# Altium project LPCB235__RLOOP__FCU.PrjPCB (part 3 of 7)

## Sheet LPCB235 - RM48 - ANALOG.SchDoc
size A3; Address1: Unit 4; DocumentNumber: 25; Revision: 2; SheetNumber: 25; SheetTotal: 37; Lockie__PCB_SUB_ASSEMBLY: Analog; Lockie__PCB_ASSEMBLY: FCU PCB; Lockie__LDL: LPCB235; Lockie__PCB_DESCRIPTION: Flight Control Unit
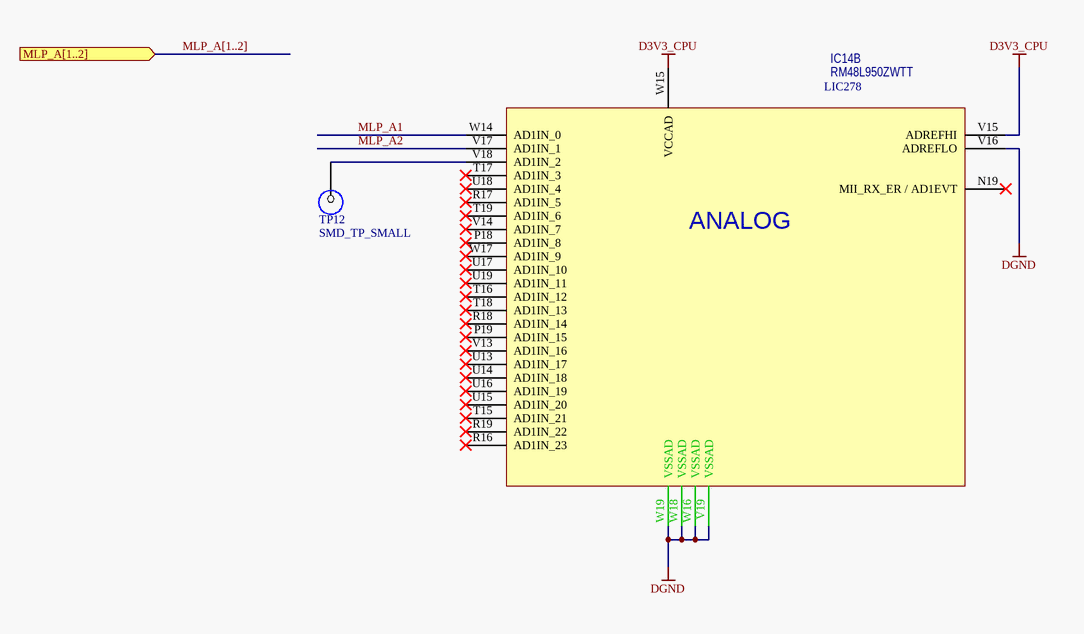
[diagram p5: LPCB235 - RM48 - ANALOG.SchDoc]

### Parts
IC14  RM48L950ZWTT  LDL_NUMBER: LIC278  [LFP054__ZWT (S-PBGA-N337)]  (part B of 10)
TP12  SMD_TP_SMALL  [SMD-TP-SMALL]  (no BOM)

### Ports
MLP_A[1..2] (in)

### Nets
D3V3_CPU: IC14.V15(ADREFHI) IC14.W15(VCCAD)
DGND: IC14.V16(ADREFLO) IC14.V19(VSSAD) IC14.W16(VSSAD) IC14.W18(VSSAD) IC14.W19(VSSAD)
MLP_A1: IC14.W14(AD1IN_0)
MLP_A2: IC14.V17(AD1IN_1)
NetIC14_N19: IC14.N19(MII_RX_ER_/_AD1EVT)
NetIC14_V18: IC14.V18(AD1IN_2) TP12.1

Not connected (* = marked no-connect by the designer): IC14 P18(AD1IN_8)* P19(AD1IN_15)* R16(AD1IN_23)* R17(AD1IN_5)* R18(AD1IN_14)* R19(AD1IN_22)* T15(AD1IN_21)* T16(AD1IN_12)* T17(AD1IN_3)* T18(AD1IN_13)* T19(AD1IN_6)* U13(AD1IN_17)* U14(AD1IN_18)* U15(AD1IN_20)* U16(AD1IN_19)* U17(AD1IN_10)* U18(AD1IN_4)* U19(AD1IN_11)* V13(AD1IN_16)* V14(AD1IN_7)* W17(AD1IN_9)*

### Buses and harness runs
bus MLP_A[1..2] = port MLP_A[1..2]

### Notes on the sheet
- PCB COMPONENT DESCRIPTION
- LDL NUMBER
- Assembly Details
- Size
- Drawing File Name
- Revision
- http://rloop.org
- Scale
- A3
- Sheet Details
- N.T.S
- Sheet:
- Of:
- (in symbol RM48L950ZWTT, part B) ANALOG

### Library data of the parts
IC14 = RM48L950ZWTT: IC, CPU, RM48 Safety CPU, SMD NFBGA337 [LIC278]; FMEDA__FUNCTION_IN_SYSTEM: SAFETY CPU 1; FMEDA__OPERATING__TEMP_MIN: -20; FMEDA__OPERATING__TEMP_TYP: 27; FMEDA__OPERATING__TEMP_MAX: 50; FMEDA__CHANNEL: COM
TP12 = SMD_TP_SMALL: SMD Test Point; FMEDA__CHANNEL: COM; FMEDA__OPERATING__CURRENT_MAX: 0; FMEDA__OPERATING__TEMP_MAX: 50; FMEDA__OPERATING__TEMP_MIN: -20; FMEDA__OPERATING__TEMP_TYP: 27; FMEDA__OPERATING__VOLTAGE_MAX: 16; FMEDA__OPERATING__VOLTAGE_TYP: 12; FMEDA__OPERATING__CURRENT_MIN: 0; FMEDA__OPERATING__CURRENT_TYP: 0; FMEDA__OPERATING__VOLTAGE_MIN: 0

## Sheet LPCB235 - RM48 - EMIF.SchDoc
size A3; Address1: Unit 4; DocumentNumber: 26; Revision: 2; SheetNumber: 26; SheetTotal: 37; Lockie__PCB_SUB_ASSEMBLY: EMIF; Lockie__PCB_ASSEMBLY: FCU PCB; Lockie__LDL: LPCB235; Lockie__PCB_DESCRIPTION: Flight Control Unit
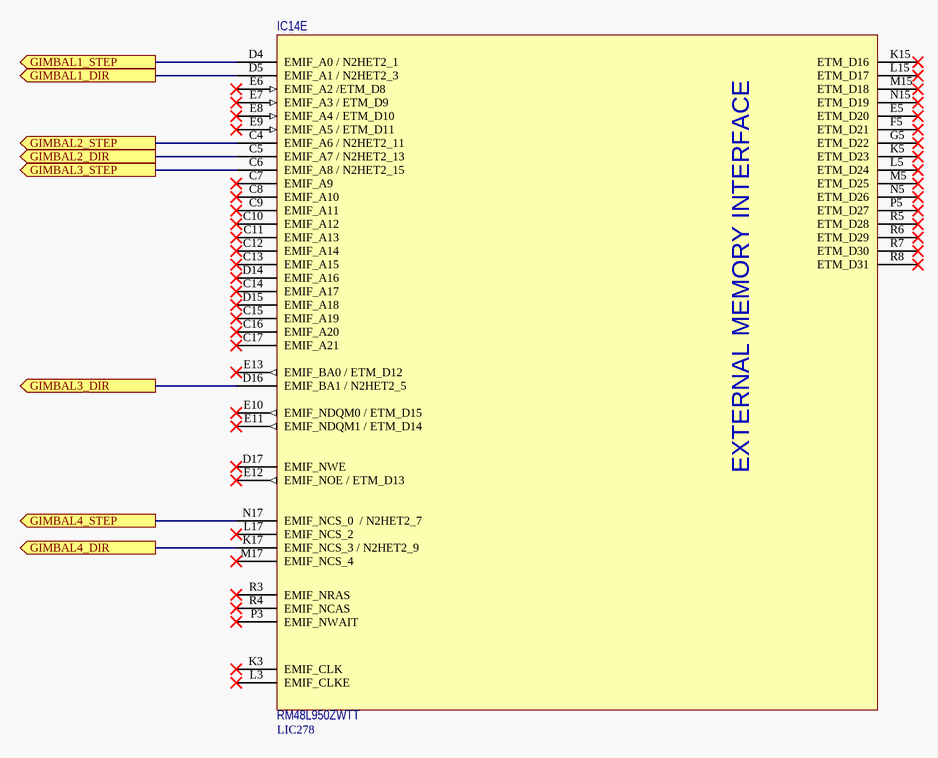
[diagram p6: LPCB235 - RM48 - EMIF.SchDoc]

### Parts
IC14  RM48L950ZWTT  LDL_NUMBER: LIC278  [LFP054__ZWT (S-PBGA-N337)]  (part E of 10)

### Ports
GIMBAL1_DIR (out), GIMBAL1_STEP (out), GIMBAL2_DIR (out), GIMBAL2_STEP (out), GIMBAL3_DIR (out), GIMBAL3_STEP (out), GIMBAL4_DIR (out), GIMBAL4_STEP (out)

### Nets
NetIC14_C4: IC14.C4(EMIF_A6_/_N2HET2_11) ; port GIMBAL2_STEP
NetIC14_C5: IC14.C5(EMIF_A7_/_N2HET2_13) ; port GIMBAL2_DIR
NetIC14_C6: IC14.C6(EMIF_A8_/_N2HET2_15) ; port GIMBAL3_STEP
NetIC14_D4: IC14.D4(EMIF_A0_/_N2HET2_1) ; port GIMBAL1_STEP
NetIC14_D5: IC14.D5(EMIF_A1_/_N2HET2_3) ; port GIMBAL1_DIR
NetIC14_D16: IC14.D16(EMIF_BA1_/_N2HET2_5) ; port GIMBAL3_DIR
NetIC14_K17: IC14.K17(EMIF_NCS_3_/_N2HET2_9) ; port GIMBAL4_DIR
NetIC14_N17: IC14.N17(EMIF_NCS_0__/_N2HET2_7) ; port GIMBAL4_STEP

Not connected (* = marked no-connect by the designer): IC14 C7(EMIF_A9)* C8(EMIF_A10)* C9(EMIF_A11)* C10(EMIF_A12)* C11(EMIF_A13)* C12(EMIF_A14)* C13(EMIF_A15)* C14(EMIF_A17)* C15(EMIF_A19)* C16(EMIF_A20)* C17(EMIF_A21)* D14(EMIF_A16)* D15(EMIF_A18)* D17(EMIF_NWE)* E5(ETM_D20)* E6(EMIF_A2_/ETM_D8)* E7(EMIF_A3_/_ETM_D9)* E8(EMIF_A4_/_ETM_D10)* E9(EMIF_A5_/_ETM_D11)* E10(EMIF_NDQM0_/_ETM_D15)* E11(EMIF_NDQM1_/_ETM_D14)* E12(EMIF_NOE_/_ETM_D13)* E13(EMIF_BA0_/_ETM_D12)* F5(ETM_D21)* G5(ETM_D22)* K3(EMIF_CLK)* K5(ETM_D23)* K15(ETM_D16)* L3(EMIF_CLKE)* L5(ETM_D24)* L15(ETM_D17)* L17(EMIF_NCS_2)* M5(ETM_D25)* M15(ETM_D18)* M17(EMIF_NCS_4)* N5(ETM_D26)* N15(ETM_D19)* P3(EMIF_NWAIT)* P5(ETM_D27)* R3(EMIF_NRAS)* R4(EMIF_NCAS)* R5(ETM_D28)* R6(ETM_D29)* R7(ETM_D30)* R8(ETM_D31)*

### Notes on the sheet
- PCB COMPONENT DESCRIPTION
- LDL NUMBER
- Assembly Details
- Size
- Drawing File Name
- Revision
- http://rloop.org
- Scale
- A3
- Sheet Details
- N.T.S
- Sheet:
- Of:
- (in symbol RM48L950ZWTT, part E) EXTERNAL MEMORY INTERFACE

### Library data of the parts
IC14 = RM48L950ZWTT: as IC14 on sheet LPCB235 - RM48 - ANALOG

## Sheet LPCB235 - RM48 - MAIN.SchDoc
size A3; Address1: Unit 4; DocumentNumber: 28; Revision: 2; SheetNumber: 28; SheetTotal: 37; Lockie__PCB_SUB_ASSEMBLY: Main; Lockie__PCB_ASSEMBLY: FCU PCB; Lockie__LDL: LPCB235; Lockie__PCB_DESCRIPTION: Flight Control Unit
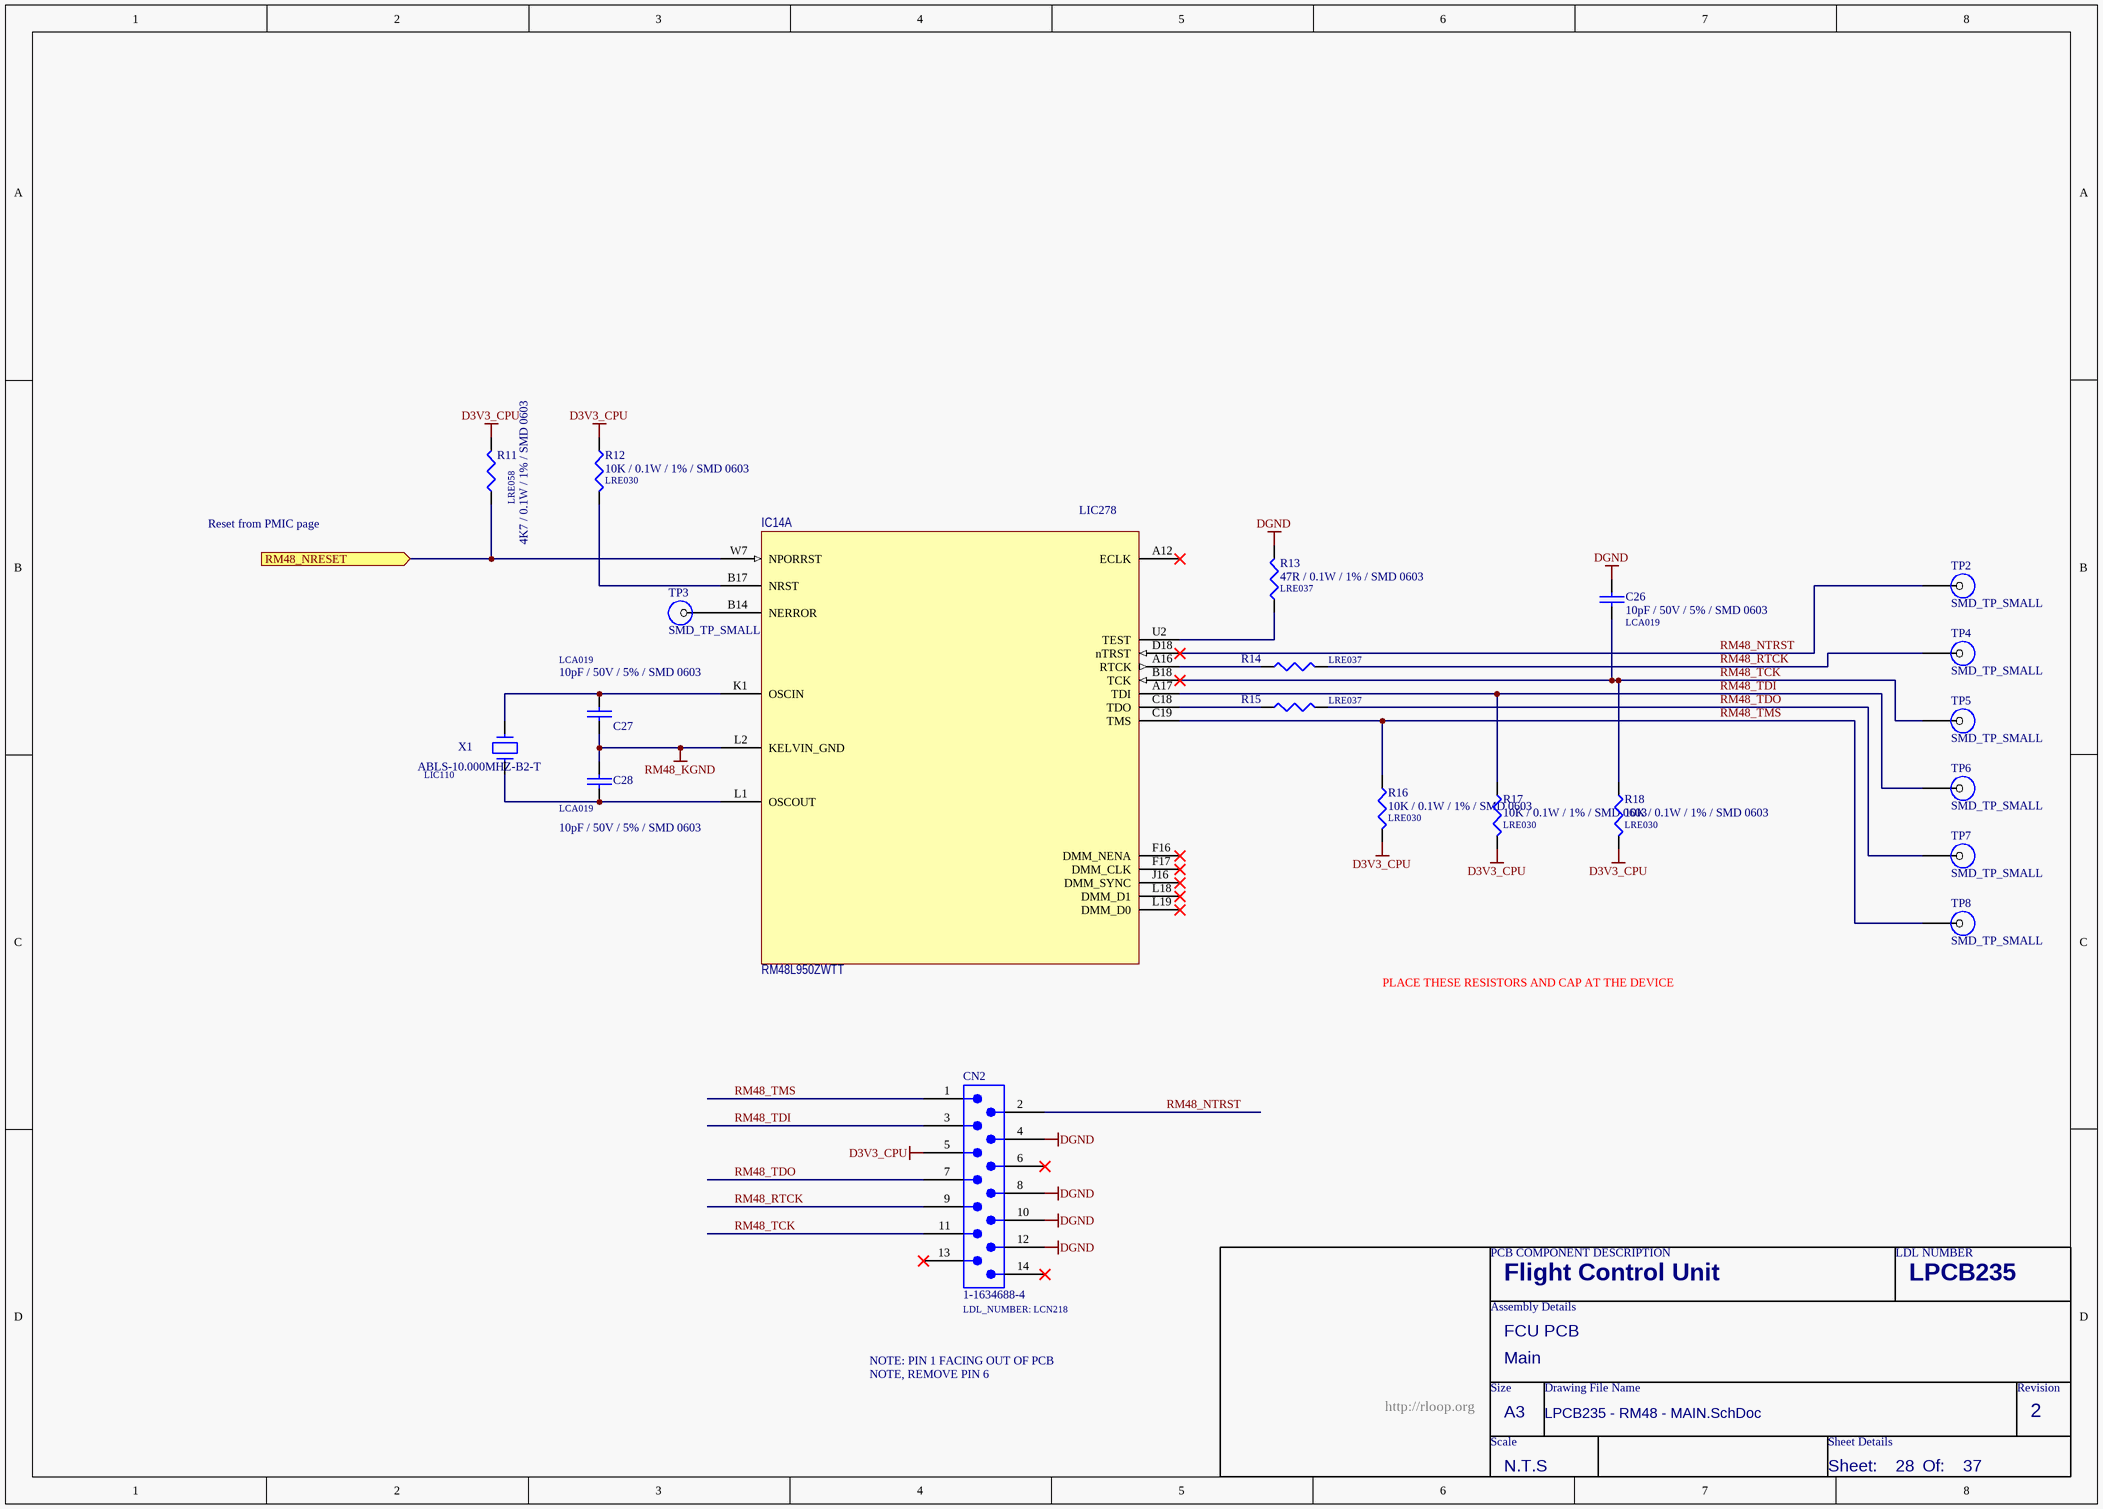
[diagram p7: LPCB235 - RM48 - MAIN.SchDoc]

### Parts
C26  10pF / 50V / 5% / SMD 0603  LDL_NUMBER: LCA019  [LFP011__CC1608-0603-IPC7351_B]
C27  10pF / 50V / 5% / SMD 0603  LDL_NUMBER: LCA019  [LFP011__CC1608-0603-IPC7351_B]
C28  10pF / 50V / 5% / SMD 0603  LDL_NUMBER: LCA019  [LFP011__CC1608-0603-IPC7351_B]
CN2  1-1634688-4  LDL_NUMBER: LCN218  [1-1634688-4]
IC14  RM48L950ZWTT  LDL_NUMBER: LIC278  [LFP054__ZWT (S-PBGA-N337)]  (part A of 10)
R11  4K7 / 0.1W / 1% / SMD 0603  LDL_NUMBER: LRE058  [LFP020__CR1608-0603-IPC7351_B]
R12  10K / 0.1W / 1% / SMD 0603  LDL_NUMBER: LRE030  [LFP020__CR1608-0603-IPC7351_B]
R13  47R / 0.1W / 1% / SMD 0603  LDL_NUMBER: LRE037  [LFP020__CR1608-0603-IPC7351_B]
R14  LDL_NUMBER: LRE037  [LFP020__CR1608-0603-IPC7351_B]  (hidden comment: 47R / 0.1W / 1% / SMD 0603)
R15  LDL_NUMBER: LRE037  [LFP020__CR1608-0603-IPC7351_B]  (hidden comment: 47R / 0.1W / 1% / SMD 0603)
R16  10K / 0.1W / 1% / SMD 0603  LDL_NUMBER: LRE030  [LFP020__CR1608-0603-IPC7351_B]
R17  10K / 0.1W / 1% / SMD 0603  LDL_NUMBER: LRE030  [LFP020__CR1608-0603-IPC7351_B]
R18  10K / 0.1W / 1% / SMD 0603  LDL_NUMBER: LRE030  [LFP020__CR1608-0603-IPC7351_B]
TP2  SMD_TP_SMALL  [SMD-TP-SMALL]  (no BOM)
TP3  SMD_TP_SMALL  [SMD-TP-SMALL]  (no BOM)
TP4  SMD_TP_SMALL  [SMD-TP-SMALL]  (no BOM)
TP5  SMD_TP_SMALL  [SMD-TP-SMALL]  (no BOM)
TP6  SMD_TP_SMALL  [SMD-TP-SMALL]  (no BOM)
TP7  SMD_TP_SMALL  [SMD-TP-SMALL]  (no BOM)
TP8  SMD_TP_SMALL  [SMD-TP-SMALL]  (no BOM)
X1  ABLS-10.000MHZ-B2-T  LDL_NUMBER: LIC110  [LFP022__XT49M]

### Ports
RM48_NRESET (in)

### Nets
D3V3_CPU: CN2.5 R11.2 R12.1 R16.2 R17.2 R18.2
DGND: C26.2 CN2.4 CN2.8 CN2.10 CN2.12 R13.2
RM48_KGND: C27.2 C28.1 IC14.L2(KELVIN_GND)
RM48_NRESET: IC14.W7(NPORRST) R11.1 ; port RM48_NRESET
RM48_NTRST: CN2.2 IC14.D18(nTRST) TP2.1
RM48_RTCK: CN2.9 R14.2 TP4.1
RM48_TCK: C26.1 CN2.11 IC14.B18(TCK) R18.1 TP5.1
RM48_TDI: CN2.3 IC14.A17(TDI) R17.1 TP6.1
RM48_TDO: CN2.7 R15.2 TP7.1
RM48_TMS: CN2.1 IC14.C19(TMS) R16.1 TP8.1
NetC27_1: C27.1 IC14.K1(OSCIN) X1.2
NetC28_2: C28.2 IC14.L1(OSCOUT) X1.1
NetIC14_A16: IC14.A16(RTCK) R14.1
NetIC14_B14: IC14.B14(NERROR) TP3.1
NetIC14_B17: IC14.B17(NRST) R12.2
NetIC14_C18: IC14.C18(TDO) R15.1
NetIC14_U2: IC14.U2(TEST) R13.1

Not connected (* = marked no-connect by the designer): CN2 6* 13* 14*; IC14 A12(ECLK)* F16(DMM_NENA)* F17(DMM_CLK)* J16(DMM_SYNC)* L18(DMM_D1)* L19(DMM_D0)*

### Notes on the sheet
- Reset from PMIC page
- PLACE THESE RESISTORS AND CAP AT THE DEVICE
- NOTE: PIN 1 FACING OUT OF PCB
- NOTE, REMOVE PIN 6
- PCB COMPONENT DESCRIPTION
- LDL NUMBER
- Assembly Details
- Size
- Drawing File Name
- Revision
- http://rloop.org
- Scale
- A3
- Sheet Details
- N.T.S
- Sheet:
- Of:

### Library data of the parts
C26-C28 = 10pF / 50V / 5% / SMD 0603: Capacitor, Ceramic Chip, 10pF, 50V, 5%, SMD 0603 [LCA019]; Value: 10p; FMEDA__OPERATING__VOLTAGE_MAX: 3.3; FMEDA__OPERATING__VOLTAGE_MIN: 0; FMEDA__OPERATING__TEMP_MAX: 50; FMEDA__OPERATING__TEMP_MIN: -20; FMEDA__OPERATING__TEMP_TYP: 27; FMEDA__CHANNEL: COM; FMEDA__FUNCTION_IN_SYSTEM: *; FMEDA__OPERATING__VOLTAGE_TYP: 3.3
CN2 = 1-1634688-4: Connector, Box Header, 14 Way, 2.54mm Straight, PTH; FMEDA__CHANNEL: COM; FMEDA__OPERATING__CURRENT_MAX: 0; FMEDA__OPERATING__TEMP_MAX: 50; FMEDA__OPERATING__TEMP_MIN: -20; FMEDA__OPERATING__TEMP_TYP: 27; FMEDA__OPERATING__VOLTAGE_MAX: 16; FMEDA__OPERATING__VOLTAGE_TYP: 12; FMEDA__OPERATING__CURRENT_MIN: 0; FMEDA__OPERATING__CURRENT_TYP: 0; FMEDA__OPERATING__VOLTAGE_MIN: 0
IC14 = RM48L950ZWTT: as IC14 on sheet LPCB235 - RM48 - ANALOG
R11 = 4K7 / 0.1W / 1% / SMD 0603: Resistor, Ceramic Chip, 4K7, 0.1W, 1%, SMD 0603 [LRE058]; VALUE: 4.7K; FMEDA__OPERATING__POWER_MAX: 0; FMEDA__OPERATING__TEMP_MAX: 50; FMEDA__OPERATING__TEMP_MIN: -20; FMEDA__OPERATING__TEMP_TYP: 27; FMEDA__CHANNEL: COM; FMEDA__OPERATING__POWER_MIN: 0; FMEDA__OPERATING__VOLTAGE_MAX: 0; FMEDA__OPERATING__VOLTAGE_MIN: 0; FMEDA__OPERATING__VOLTAGE_TYP: 0; FMEDA__FUNCTION_IN_SYSTEM: *
R12 R16-R18 = 10K / 0.1W / 1% / SMD 0603: Resistor, Ceramic Chip, 10K, 0.1W, 1%, SMD 0603 [LRE030]; FMEDA__OPERATING__POWER_MAX: 0; FMEDA__OPERATING__TEMP_MAX: 50; FMEDA__OPERATING__TEMP_MIN: -20; FMEDA__OPERATING__TEMP_TYP: 27; FMEDA__CHANNEL: COM; Value: 10K; FMEDA__OPERATING__POWER_MIN: 0; FMEDA__OPERATING__VOLTAGE_MAX: 0; FMEDA__OPERATING__VOLTAGE_MIN: 0; FMEDA__OPERATING__VOLTAGE_TYP: 0; FMEDA__FUNCTION_IN_SYSTEM: *
R13-R15 = 47R / 0.1W / 1% / SMD 0603: Resistor, Ceramic Chip, 47R, 0.1W, 1%, SMD 0603 [LRE037]; VALUE: 47; FMEDA__OPERATING__POWER_MAX: 0; FMEDA__OPERATING__TEMP_MAX: 50; FMEDA__OPERATING__TEMP_MIN: -20; FMEDA__OPERATING__TEMP_TYP: 27; FMEDA__CHANNEL: COM; FMEDA__OPERATING__POWER_MIN: 0; FMEDA__OPERATING__VOLTAGE_MAX: 0; FMEDA__OPERATING__VOLTAGE_MIN: 0; FMEDA__OPERATING__VOLTAGE_TYP: 0; FMEDA__FUNCTION_IN_SYSTEM: *
TP2-TP8 = SMD_TP_SMALL: as TP12 on sheet LPCB235 - RM48 - ANALOG; FMEDA__OPERATING__CURRENT_MIN: 0; FMEDA__OPERATING__CURRENT_TYP: 0; FMEDA__OPERATING__VOLTAGE_MIN: 0
X1 = ABLS-10.000MHZ-B2-T: Crystal, 10MHz, 18pF, SMD [LIC110]; FMEDA__OPERATING__TEMP_MAX: 50; FMEDA__OPERATING__TEMP_TYP: 27; FMEDA__OPERATING__TEMP_MIN: -20; FMEDA__CHANNEL: COM; FMEDA__FUNCTION_IN_SYSTEM: *

## Sheet LPCB235 - CAN Interface.SchDoc
size A3; Address1: Unit 4; DocumentNumber: 22; Revision: 2; SheetNumber: 22; SheetTotal: 37; Lockie__PCB_SUB_ASSEMBLY: CAN Interface; Lockie__PCB_ASSEMBLY: FCU PCB; Lockie__LDL: LPCB235; Lockie__PCB_DESCRIPTION: Flight Control Unit
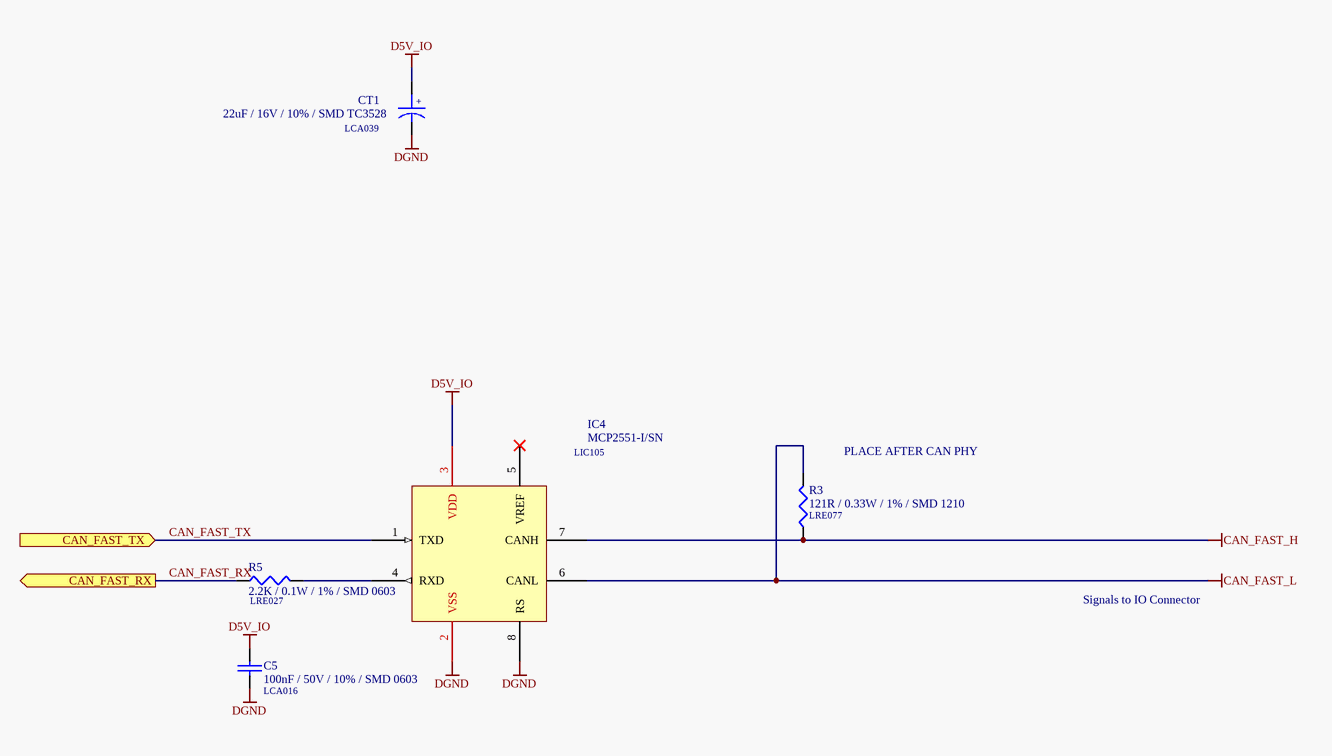
[diagram p8: LPCB235 - CAN Interface.SchDoc]

### Parts
C5  100nF / 50V / 10% / SMD 0603  LDL_NUMBER: LCA016  [LFP011__CC1608-0603-IPC7351_B]
CT1  22uF / 16V / 10% / SMD TC3528  LDL_NUMBER: LCA039  [LFP018__TC3528]
IC4  MCP2551-I/SN  LDL_NUMBER: LIC105  [LFP017__SO-G8/Y1.9]
R3  121R / 0.33W / 1% / SMD 1210  LDL_NUMBER: LRE077  [LFP028__CR3225-1210]
R5  2.2K / 0.1W / 1% / SMD 0603  LDL_NUMBER: LRE027  [LFP020__CR1608-0603-IPC7351_B]

### Ports
CAN_FAST_RX (out), CAN_FAST_TX (in)

### Nets
CAN_FAST_H: IC4.7(CANH) R3.1
CAN_FAST_L: IC4.6(CANL) R3.2
D5V_IO: C5.1 CT1.1 IC4.3(VDD)
DGND: C5.2 CT1.2 IC4.2(VSS) IC4.8(RS)
CAN_FAST_RX: R5.1 ; port CAN_FAST_RX
CAN_FAST_TX: IC4.1(TXD) ; port CAN_FAST_TX
NetIC4_4: IC4.4(RXD) R5.2

Not connected (* = marked no-connect by the designer): IC4 5(VREF)*

### Notes on the sheet
- (near R3) PLACE AFTER CAN PHY
- Signals to IO Connector
- PCB COMPONENT DESCRIPTION
- LDL NUMBER
- Assembly Details
- Size
- Drawing File Name
- Revision
- http://rloop.org
- Scale
- A3
- Sheet Details
- N.T.S
- Sheet:
- Of:
- (in symbol 22uF / 16V / 10% / SMD TC3528) +

### Library data of the parts
C5 = 100nF / 50V / 10% / SMD 0603: Capacitor, Ceramic Chip, 100nF (0.1uF), 50V, 5%, SMD 0603 [LCA016]; Value: 100n; FMEDA__OPERATING__VOLTAGE_MIN: 0; FMEDA__OPERATING__VOLTAGE_MAX: 3.3; FMEDA__OPERATING__TEMP_MIN: -20; FMEDA__OPERATING__TEMP_TYP: 27; FMEDA__OPERATING__TEMP_MAX: 50; FMEDA__CHANNEL: COM; FMEDA__FUNCTION_IN_SYSTEM: *; FMEDA__OPERATING__VOLTAGE_TYP: 3.3
CT1 = 22uF / 16V / 10% / SMD TC3528: Capacitor, Tantalum, 22uF, 16V, 10%, SMD TC3528 (BCASE) [LCA039]; Value: 22u; FMEDA__OPERATING__VOLTAGE_MAX: 3.3; FMEDA__OPERATING__VOLTAGE_MIN: 0; FMEDA__OPERATING__TEMP_MAX: 50; FMEDA__OPERATING__TEMP_MIN: -20; FMEDA__OPERATING__TEMP_TYP: 27; FMEDA__FUNCTION_IN_SYSTEM: CAN PHY BYPASS CAP; FMEDA__CHANNEL: COM; FMEDA__OPERATING__VOLTAGE_TYP: 3.3
IC4 = MCP2551-I/SN: IC, High Speed CAN Transceiver, SMD SOIC8 [LIC105]; FMEDA__OPERATING__TEMP_MAX: 50; FMEDA__OPERATING__TEMP_MIN: -20; FMEDA__OPERATING__TEMP_TYP: 27; FMEDA__OPERATING__VOLTAGE_MAX: 0; FMEDA__FUNCTION_IN_SYSTEM: CAN PHY 1; FMEDA__CHANNEL: COM; FMEDA__OPERATING__VOLTAGE_MIN: 0; FMEDA__OPERATING__VOLTAGE_TYP: 0
R3 = 121R / 0.33W / 1% / SMD 1210: Resistor, Ceramic Chip, 121R, 0.33W, 1%, SMD 1210 [LRE077]; VALUE: 121; FMEDA__OPERATING__POWER_MAX: 0; FMEDA__OPERATING__TEMP_MAX: 50; FMEDA__OPERATING__TEMP_MIN: -20; FMEDA__OPERATING__TEMP_TYP: 27; FMEDA__CHANNEL: COM; FMEDA__OPERATING__POWER_MIN: 0; FMEDA__OPERATING__VOLTAGE_MAX: 0; FMEDA__OPERATING__VOLTAGE_MIN: 0; FMEDA__OPERATING__VOLTAGE_TYP: 0; FMEDA__FUNCTION_IN_SYSTEM: *
R5 = 2.2K / 0.1W / 1% / SMD 0603: Resistor, Ceramic Chip, 2.2K, 0.1W, 1%, SMD 0603 [LRE027]; FMEDA__OPERATING__VOLTAGE_MIN: 0; FMEDA__FUNCTION_IN_SYSTEM: CAN PHY 1 ILIM; FMEDA__OPERATING__TEMP_MIN: -20; FMEDA__OPERATING__TEMP_TYP: 27; FMEDA__OPERATING__TEMP_MAX: 50; FMEDA__CHANNEL: COM; VALUE: 2.2K; FMEDA__OPERATING__VOLTAGE_MAX: 0; FMEDA__OPERATING__POWER_MIN: 0; FMEDA__OPERATING__POWER_MAX: 0; FMEDA__OPERATING__VOLTAGE_TYP: 0

## Sheet LPCB235 - RM48 - SERIAL.SchDoc
size A3; Address1: Unit 4; DocumentNumber: 31; Revision: 2; SheetNumber: 31; SheetTotal: 37; Lockie__PCB_SUB_ASSEMBLY: Serial IO; Lockie__PCB_ASSEMBLY: FCU PCB; Lockie__LDL: LPCB235; Lockie__PCB_DESCRIPTION: Flight Control Unit
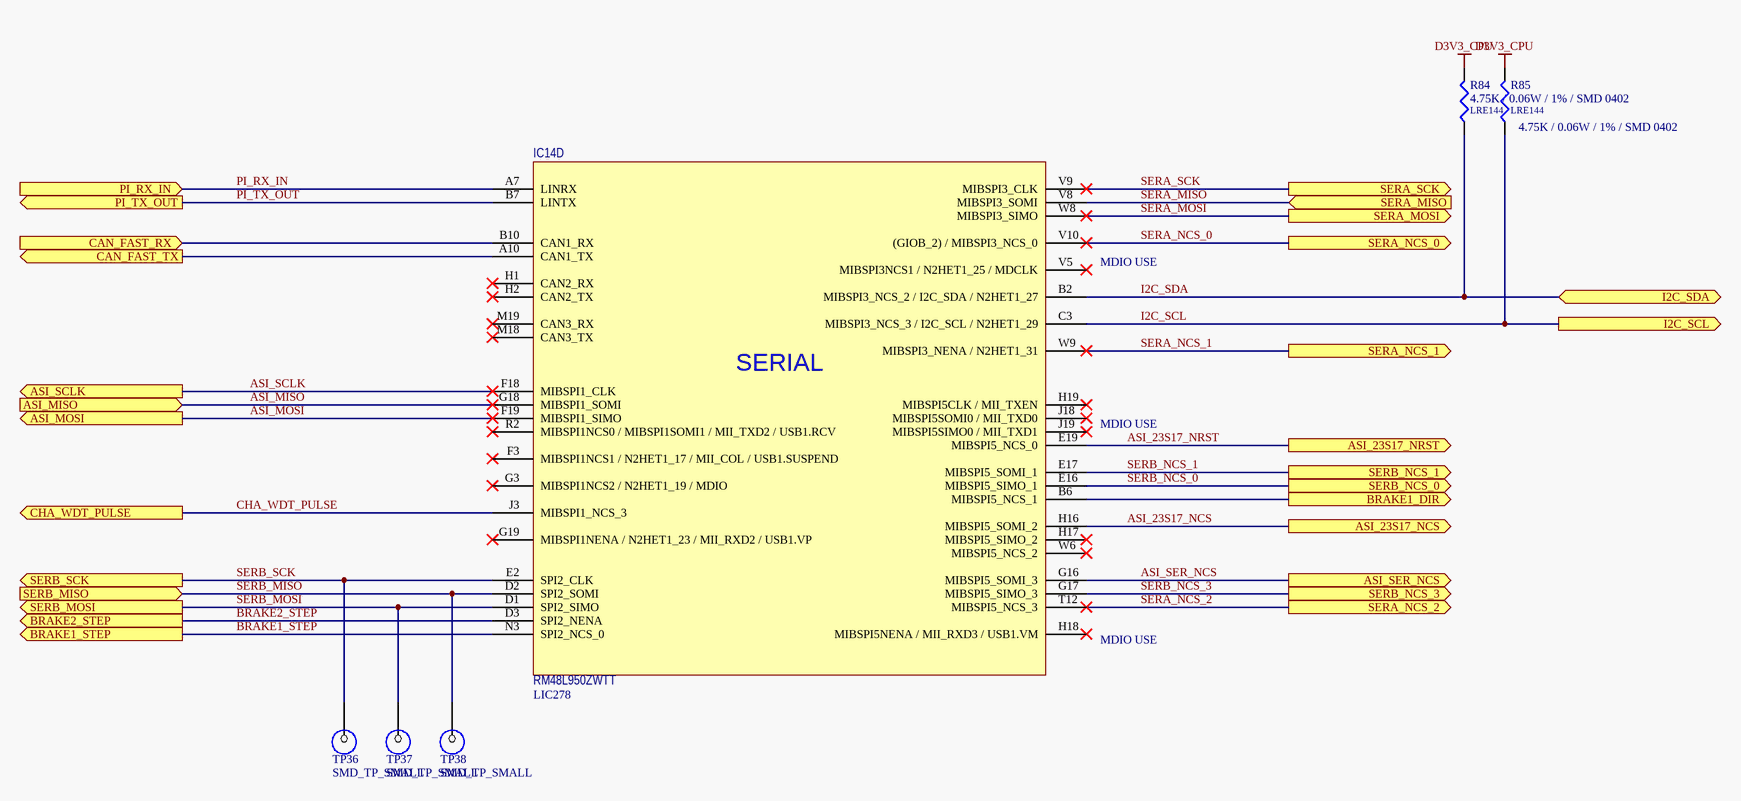
[diagram p9: LPCB235 - RM48 - SERIAL.SchDoc]

### Parts
IC14  RM48L950ZWTT  LDL_NUMBER: LIC278  [LFP054__ZWT (S-PBGA-N337)]  (part D of 10)
R84  4.75K / 0.06W / 1% / SMD 0402  LDL_NUMBER: LRE144  [LFP030__CR1005-0402-IPC7351]
R85  4.75K / 0.06W / 1% / SMD 0402  LDL_NUMBER: LRE144  [LFP030__CR1005-0402-IPC7351]
TP36  SMD_TP_SMALL  [SMD-TP-SMALL]  (no BOM)
TP37  SMD_TP_SMALL  [SMD-TP-SMALL]  (no BOM)
TP38  SMD_TP_SMALL  [SMD-TP-SMALL]  (no BOM)

### Ports
ASI_23S17_NCS (out), ASI_23S17_NRST (out), ASI_MISO (in), ASI_MOSI (out), ASI_SCLK (out), ASI_SER_NCS (out), BRAKE1_DIR (out), BRAKE1_STEP (out), BRAKE2_STEP (out), CAN_FAST_RX (in), CAN_FAST_TX (out), CHA_WDT_PULSE (out), I2C_SCL (out), I2C_SDA (bidir), PI_RX_IN (in), PI_TX_OUT (out), SERA_MISO (in), SERA_MOSI (out), SERA_NCS_0 (out), SERA_NCS_1 (out), SERA_NCS_2 (out), SERA_SCK (out), SERB_MISO (in), SERB_MOSI (out), SERB_NCS_0 (out), SERB_NCS_1 (out), SERB_NCS_3 (out), SERB_SCK (out)

### Nets
D3V3_CPU: R84.2 R85.2
ASI_23S17_NCS: IC14.H16(MIBSPI5_SOMI_2) ; port ASI_23S17_NCS
ASI_23S17_NRST: IC14.E19(MIBSPI5_NCS_0) ; port ASI_23S17_NRST
ASI_MISO: IC14.G18(MIBSPI1_SOMI) ; port ASI_MISO
ASI_MOSI: IC14.F19(MIBSPI1_SIMO) ; port ASI_MOSI
ASI_SCLK: IC14.F18(MIBSPI1_CLK) ; port ASI_SCLK
ASI_SER_NCS: IC14.G16(MIBSPI5_SOMI_3) ; port ASI_SER_NCS
BRAKE1_DIR: IC14.B6(MIBSPI5_NCS_1) ; port BRAKE1_DIR
BRAKE1_STEP: IC14.N3(SPI2_NCS_0) ; port BRAKE1_STEP
BRAKE2_STEP: IC14.D3(SPI2_NENA) ; port BRAKE2_STEP
CAN_FAST_RX: IC14.B10(CAN1_RX) ; port CAN_FAST_RX
CAN_FAST_TX: IC14.A10(CAN1_TX) ; port CAN_FAST_TX
CHA_WDT_PULSE: IC14.J3(MIBSPI1_NCS_3) ; port CHA_WDT_PULSE
I2C_SCL: IC14.C3(MIBSPI3_NCS_3_/_I2C_SCL_/_N2HET1_29) R85.1 ; port I2C_SCL
I2C_SDA: IC14.B2(MIBSPI3_NCS_2_/_I2C_SDA_/_N2HET1_27) R84.1 ; port I2C_SDA
MAC_MDCLK: IC14.V5(MIBSPI3NCS1_/_N2HET1_25_/_MDCLK)
MAC_MDIO: IC14.G3(MIBSPI1NCS2_/_N2HET1_19_/_MDIO)
MII_COL: IC14.F3(MIBSPI1NCS1_/_N2HET1_17_/_MII_COL_/_USB1.SUSPEND)
MII_RXD2: IC14.G19(MIBSPI1NENA_/_N2HET1_23_/_MII_RXD2_/_USB1.VP)
MII_RXD3: IC14.H18(MIBSPI5NENA_/_MII_RXD3_/_USB1.VM)
PI_RX_IN: IC14.A7(LINRX) ; port PI_RX_IN
PI_TX_OUT: IC14.B7(LINTX) ; port PI_TX_OUT
SERA_MISO: IC14.V8(MIBSPI3_SOMI) ; port SERA_MISO
SERA_MOSI: IC14.W8(MIBSPI3_SIMO) ; port SERA_MOSI
SERA_NCS_0: IC14.V10((GIOB_2)_/_MIBSPI3_NCS_0) ; port SERA_NCS_0
SERA_NCS_1: IC14.W9(MIBSPI3_NENA_/_N2HET1_31) ; port SERA_NCS_1
SERA_NCS_2: IC14.T12(MIBSPI5_NCS_3) ; port SERA_NCS_2
SERA_SCK: IC14.V9(MIBSPI3_CLK) ; port SERA_SCK
SERB_MISO: IC14.D2(SPI2_SOMI) TP38.1 ; port SERB_MISO
SERB_MOSI: IC14.D1(SPI2_SIMO) TP37.1 ; port SERB_MOSI
SERB_NCS_0: IC14.E16(MIBSPI5_SIMO_1) ; port SERB_NCS_0
SERB_NCS_1: IC14.E17(MIBSPI5_SOMI_1) ; port SERB_NCS_1
SERB_NCS_3: IC14.G17(MIBSPI5_SIMO_3) ; port SERB_NCS_3
SERB_SCK: IC14.E2(SPI2_CLK) TP36.1 ; port SERB_SCK
NetIC14_H19: IC14.H19(MIBSPI5CLK_/_MII_TXEN)
NetIC14_J18: IC14.J18(MIBSPI5SOMI0_/_MII_TXD0)
NetIC14_J19: IC14.J19(MIBSPI5SIMO0_/_MII_TXD1)
NetIC14_R2: IC14.R2(MIBSPI1NCS0_/_MIBSPI1SOMI1_/_MII_TXD2_/_USB1.RCV)

Not connected (* = marked no-connect by the designer): IC14 H1(CAN2_RX)* H2(CAN2_TX)* H17(MIBSPI5_SIMO_2)* M18(CAN3_TX)* M19(CAN3_RX)* W6(MIBSPI5_NCS_2)*

### Notes on the sheet
- MDIO USE
- PCB COMPONENT DESCRIPTION
- LDL NUMBER
- Assembly Details
- Size
- Drawing File Name
- Revision
- http://rloop.org
- Scale
- A3
- Sheet Details
- N.T.S
- Sheet:
- Of:
- (in symbol RM48L950ZWTT, part D) SERIAL

### Library data of the parts
IC14 = RM48L950ZWTT: as IC14 on sheet LPCB235 - RM48 - ANALOG
R84 R85 = 4.75K / 0.06W / 1% / SMD 0402: Resistor, Ceramic Chip, 4.75K, 0.0625W, 1%, SMD 0402 [LRE144]; Value: 4750; FMEDA__OPERATING__POWER_MAX: 0; FMEDA__OPERATING__TEMP_MAX: 50; FMEDA__OPERATING__TEMP_MIN: -20; FMEDA__OPERATING__TEMP_TYP: 27; FMEDA__CHANNEL: COM; FMEDA__OPERATING__POWER_MIN: 0; FMEDA__OPERATING__VOLTAGE_MAX: 0; FMEDA__OPERATING__VOLTAGE_MIN: 0; FMEDA__OPERATING__VOLTAGE_TYP: 0; FMEDA__FUNCTION_IN_SYSTEM: *
TP36-TP38 = SMD_TP_SMALL: as TP12 on sheet LPCB235 - RM48 - ANALOG; FMEDA__OPERATING__CURRENT_MIN: 0; FMEDA__OPERATING__CURRENT_TYP: 0; FMEDA__OPERATING__VOLTAGE_MIN: 0

## Sheet LPCB235 - RM48 - 100BASET.SchDoc
size A3; Address1: Unit 4; DocumentNumber: 24; Revision: 2; SheetNumber: 24; SheetTotal: 37; Lockie__PCB_SUB_ASSEMBLY: EMAC; Lockie__PCB_ASSEMBLY: FCU PCB; Lockie__LDL: LPCB235; Lockie__PCB_DESCRIPTION: Flight Control Unit
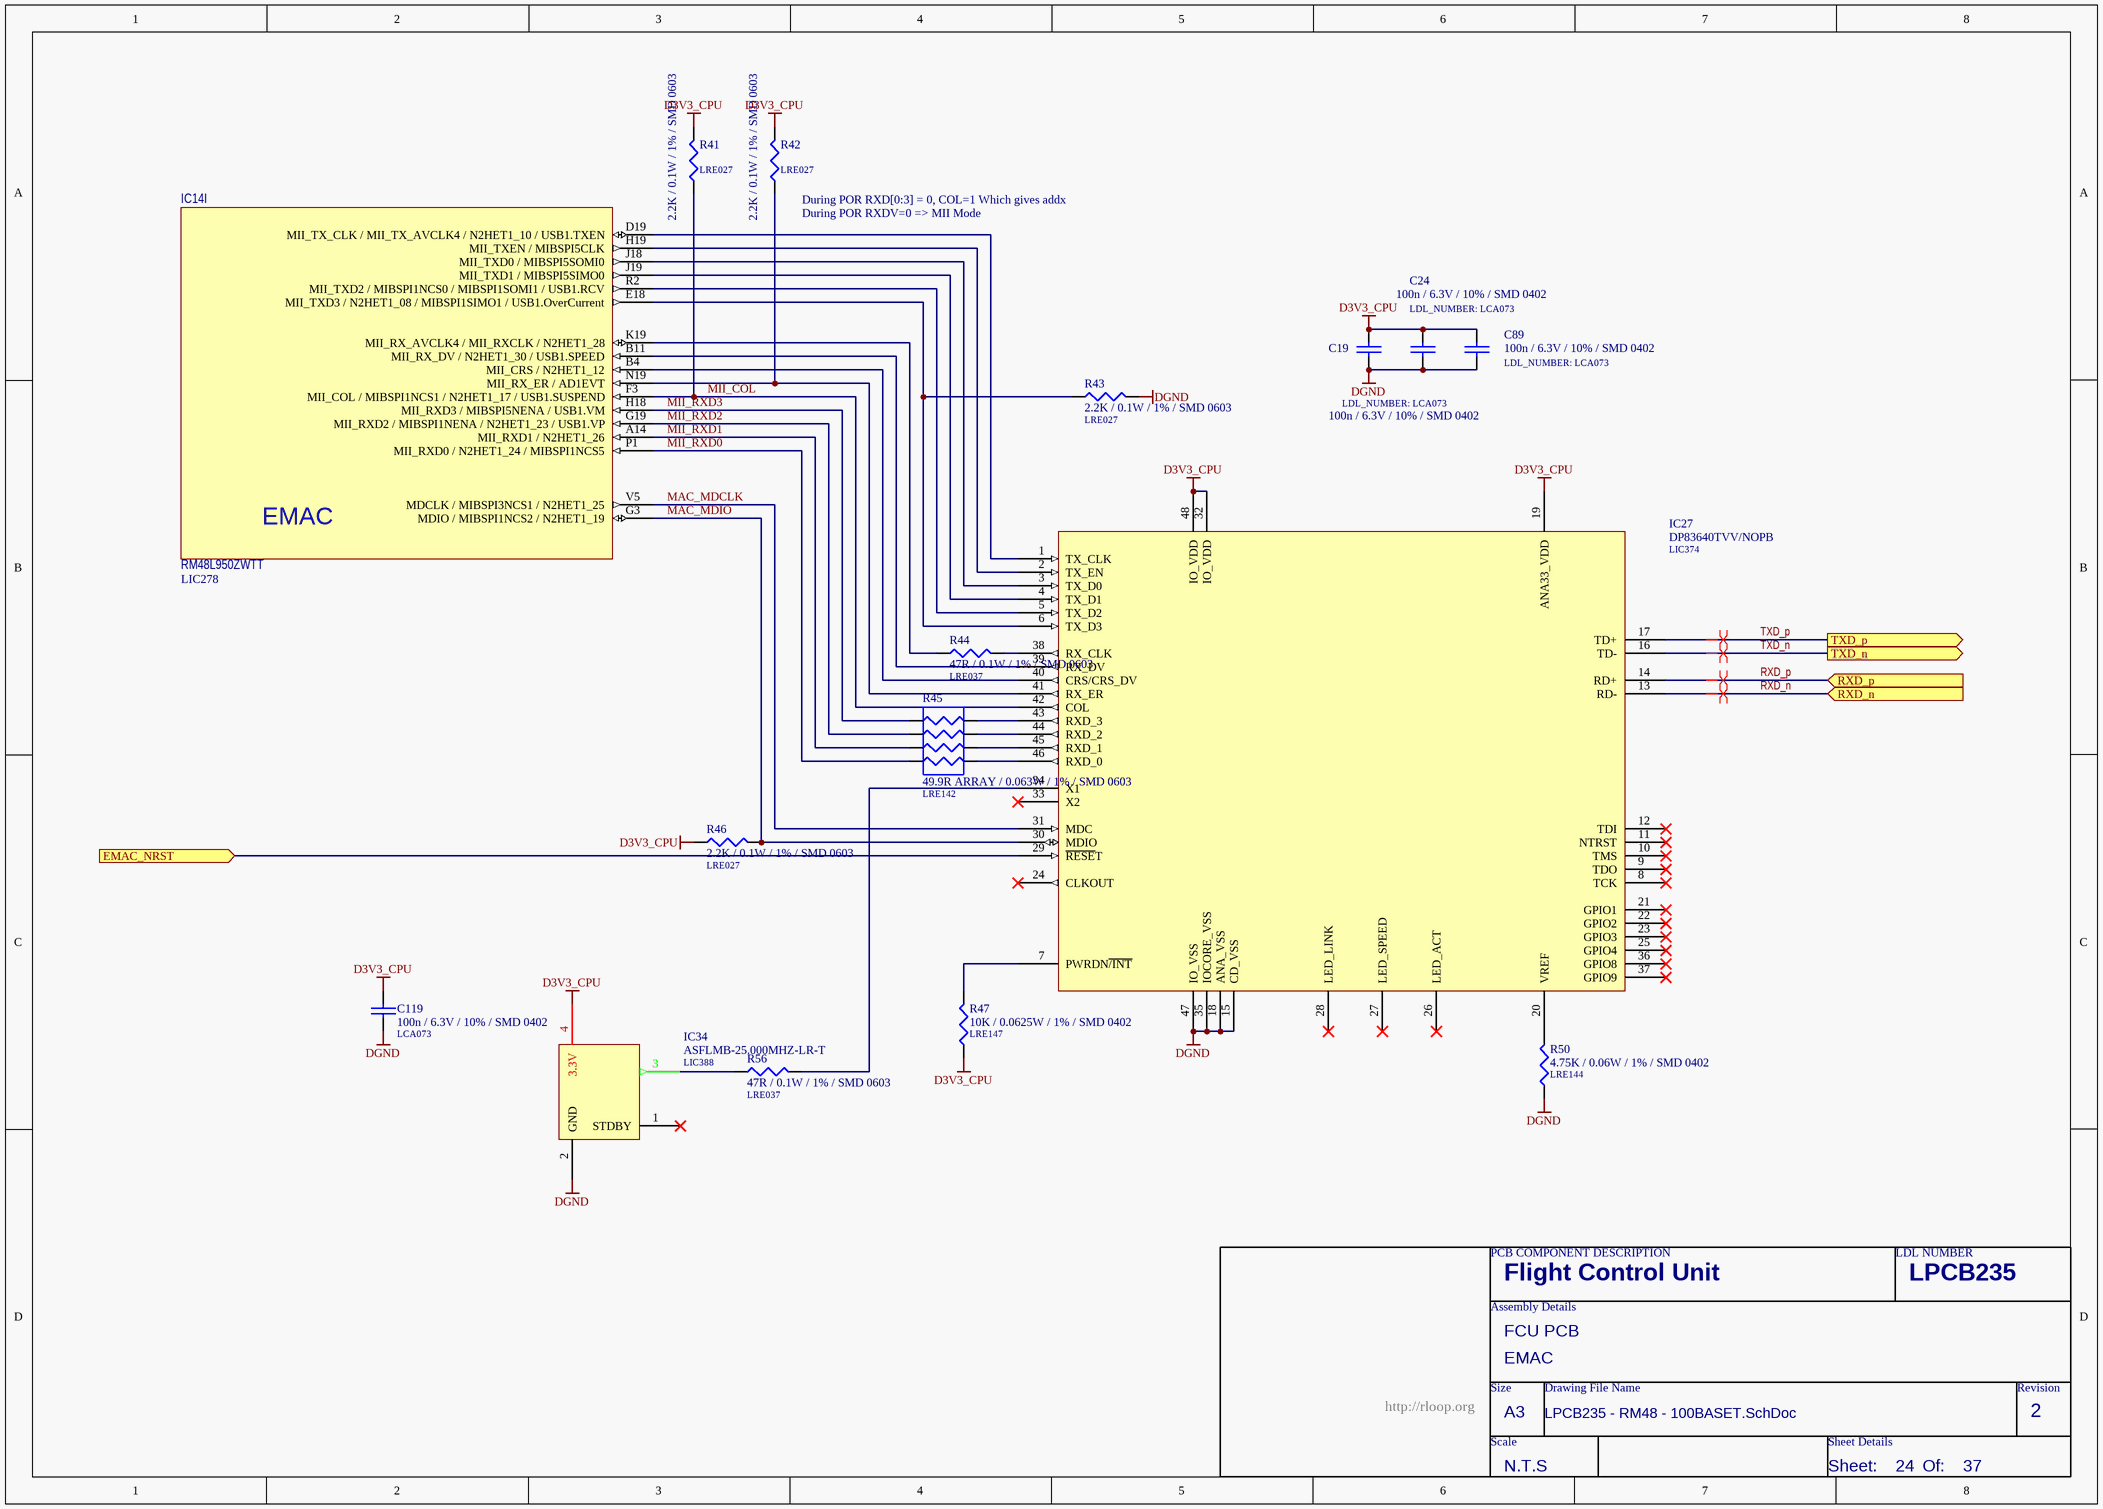
[diagram p10: LPCB235 - RM48 - 100BASET.SchDoc]

### Parts
C19  100n / 6.3V / 10% / SMD 0402  LDL_NUMBER: LCA073  [LFP012__CC1005-0402-IPC7351_B]
C24  100n / 6.3V / 10% / SMD 0402  LDL_NUMBER: LCA073  [LFP012__CC1005-0402-IPC7351_B]
C89  100n / 6.3V / 10% / SMD 0402  LDL_NUMBER: LCA073  [LFP012__CC1005-0402-IPC7351_B]
C119  100n / 6.3V / 10% / SMD 0402  LDL_NUMBER: LCA073  [LFP012__CC1005-0402-IPC7351_B]
IC14  RM48L950ZWTT  LDL_NUMBER: LIC278  [LFP054__ZWT (S-PBGA-N337)]  (part I of 10)
IC27  DP83640TVV/NOPB  LDL_NUMBER: LIC374  [LFP058__F-QFP7X7-G48]
IC34  ASFLMB-25.000MHZ-LR-T  LDL_NUMBER: LIC388  [LFP072__ASFLMB]
R41  2.2K / 0.1W / 1% / SMD 0603  LDL_NUMBER: LRE027  [LFP020__CR1608-0603-IPC7351_B]
R42  2.2K / 0.1W / 1% / SMD 0603  LDL_NUMBER: LRE027  [LFP020__CR1608-0603-IPC7351_B]
R43  2.2K / 0.1W / 1% / SMD 0603  LDL_NUMBER: LRE027  [LFP020__CR1608-0603-IPC7351_B]
R44  47R / 0.1W / 1% / SMD 0603  LDL_NUMBER: LRE037  [LFP020__CR1608-0603-IPC7351_B]
R45  49.9R ARRAY / 0.063W / 1% / SMD 0603  LDL_NUMBER: LRE142  [LFP065__RESPACK4-0603]
R46  2.2K / 0.1W / 1% / SMD 0603  LDL_NUMBER: LRE027  [LFP020__CR1608-0603-IPC7351_B]
R47  10K / 0.0625W / 1% / SMD 0402  LDL_NUMBER: LRE147  [LFP030__CR1005-0402-IPC7351]
R50  4.75K / 0.06W / 1% / SMD 0402  LDL_NUMBER: LRE144  [LFP030__CR1005-0402-IPC7351]
R56  47R / 0.1W / 1% / SMD 0603  LDL_NUMBER: LRE037  [LFP020__CR1608-0603-IPC7351_B]

### Ports
EMAC_NRST (in), RXD_n (in), RXD_p (in), TXD_n (out), TXD_p (out)

### Nets
D3V3_CPU: C19.1 C24.1 C89.1 C119.1 IC27.19(ANA33_VDD) IC27.32(IO_VDD) IC27.48(IO_VDD) IC34.4(3.3V) R41.2 R42.2 R46.1 R47.1
DGND: C19.2 C24.2 C89.2 C119.2 IC27.15(CD_VSS) IC27.18(ANA_VSS) IC27.35(IOCORE_VSS) IC27.47(IO_VSS) IC34.2(GND) R43.2 R50.1
MAC_MDCLK: IC14.V5(MDCLK_/_MIBSPI3NCS1_/_N2HET1_25) IC27.31(MDC)
MAC_MDIO: IC14.G3(MDIO_/_MIBSPI1NCS2_/_N2HET1_19) IC27.30(MDIO) R46.2
MII_COL: IC14.F3(MII_COL_/_MIBSPI1NCS1_/_N2HET1_17_/_USB1.SUSPEND) IC27.42(COL) R41.1
MII_RXD0: IC14.P1(MII_RXD0_/_N2HET1_24_/_MIBSPI1NCS5) R45.4
MII_RXD1: IC14.A14(MII_RXD1_/_N2HET1_26) R45.3
MII_RXD2: IC14.G19(MII_RXD2_/_MIBSPI1NENA_/_N2HET1_23_/_USB1.VP) R45.2
MII_RXD3: IC14.H18(MII_RXD3_/_MIBSPI5NENA_/_USB1.VM) R45.1
RXD_n: IC27.13(RD-) ; port RXD_n
RXD_p: IC27.14(RD+) ; port RXD_p
TXD_n: IC27.16(TD-) ; port TXD_n
TXD_p: IC27.17(TD+) ; port TXD_p
NetIC14_B4: IC14.B4(MII_CRS_/_N2HET1_12) IC27.40(CRS/CRS_DV)
NetIC14_B11: IC14.B11(MII_RX_DV_/_N2HET1_30_/_USB1.SPEED) IC27.39(RX_DV)
NetIC14_D19: IC14.D19(MII_TX_CLK_/_MII_TX_AVCLK4_/_N2HET1_10_/_USB1.TXEN) IC27.1(TX_CLK)
NetIC14_E18: IC14.E18(MII_TXD3_/_N2HET1_08_/_MIBSPI1SIMO1_/_USB1.OverCurrent) IC27.6(TX_D3) R43.1
NetIC14_H19: IC14.H19(MII_TXEN_/_MIBSPI5CLK) IC27.2(TX_EN)
NetIC14_J18: IC14.J18(MII_TXD0_/_MIBSPI5SOMI0) IC27.3(TX_D0)
NetIC14_J19: IC14.J19(MII_TXD1_/_MIBSPI5SIMO0) IC27.4(TX_D1)
NetIC14_K18: IC27.29(~{RESE}T) ; port EMAC_NRST
NetIC14_K19: IC14.K19(MII_RX_AVCLK4_/_MII_RXCLK_/_N2HET1_28) R44.1
NetIC14_N19: IC14.N19(MII_RX_ER_/_AD1EVT) IC27.41(RX_ER) R42.1
NetIC14_R2: IC14.R2(MII_TXD2_/_MIBSPI1NCS0_/_MIBSPI1SOMI1_/_USB1.RCV) IC27.5(TX_D2)
NetIC27_7: IC27.7(PWRDN~{/INT}) R47.2
NetIC27_20: IC27.20(VREF) R50.2
NetIC27_34: IC27.34(X1) R56.2
NetIC27_38: IC27.38(RX_CLK) R44.2
NetIC27_43: IC27.43(RXD_3) R45.8
NetIC27_44: IC27.44(RXD_2) R45.7
NetIC27_45: IC27.45(RXD_1) R45.6
NetIC27_46: IC27.46(RXD_0) R45.5
NetIC34_3: IC34.3(OUT) R56.1

Not connected (* = marked no-connect by the designer): IC27 8(TCK)* 9(TDO)* 10(TMS)* 11(NTRST)* 12(TDI)* 21(GPIO1)* 22(GPIO2)* 23(GPIO3)* 24(CLKOUT)* 25(GPIO4)* 26(LED_ACT)* 27(LED_SPEED)* 28(LED_LINK)* 33(X2)* 36(GPIO8)* 37(GPIO9)*; IC34 1(STDBY)*

### Layout directives
differential pair: RXD_n, RXD_p, TXD_n, TXD_p

### Notes on the sheet
- (near R42) During POR RXD[0:3] = 0, COL=1 Which gives addx
- (near R42) During POR RXDV=0 => MII Mode
- PCB COMPONENT DESCRIPTION
- LDL NUMBER
- Assembly Details
- Size
- Drawing File Name
- Revision
- http://rloop.org
- Scale
- A3
- Sheet Details
- N.T.S
- Sheet:
- Of:
- (in symbol RM48L950ZWTT, part I) EMAC

### Library data of the parts
C19 C24 C89 C119 = 100n / 6.3V / 10% / SMD 0402: Capacitor, Ceramic Chip, 100nF (0.1uF), 6.3V, 10%, SMD 0402 [LCA073]; FMEDA__OPERATING__TEMP_MAX: 50; FMEDA__OPERATING__TEMP_TYP: 27; FMEDA__OPERATING__TEMP_MIN: -20; FMEDA__OPERATING__VOLTAGE_MAX: 3.3; FMEDA__OPERATING__VOLTAGE_MIN: 0; FMEDA__CHANNEL: COM; Value: 100n; FMEDA__FUNCTION_IN_SYSTEM: *; FMEDA__OPERATING__VOLTAGE_TYP: 3.3
IC14 = RM48L950ZWTT: as IC14 on sheet LPCB235 - RM48 - ANALOG
IC27 = DP83640TVV/NOPB: IC, Ethernet Transceiver, Precision Real Time Protocol, SMD LQFP48 [LIC374]; FMEDA__OPERATING__TEMP_MAX: 50; FMEDA__OPERATING__TEMP_MIN: -20; FMEDA__OPERATING__TEMP_TYP: 27; FMEDA__CHANNEL: COM; FMEDA__OPERATING__VOLTAGE_MAX: 3.3; FMEDA__OPERATING__VOLTAGE_MIN: 0; FMEDA__FUNCTION_IN_SYSTEM: *; FMEDA__OPERATING__VOLTAGE_TYP: 3.3
IC34 = ASFLMB-25.000MHZ-LR-T: IC, Oscillator Module, 25MHz, 3.3V, SMD [LIC388]; FMEDA__OPERATING__TEMP_MAX: 50; FMEDA__OPERATING__TEMP_MIN: -20; FMEDA__OPERATING__TEMP_TYP: 27; FMEDA__OPERATING__VOLTAGE_MAX: 3.3; FMEDA__OPERATING__VOLTAGE_MIN: 0; FMEDA__CHANNEL: COM; FMEDA__OPERATING__VOLTAGE_TYP: 3.3; FMEDA__FUNCTION_IN_SYSTEM: *
R41-R43 = 2.2K / 0.1W / 1% / SMD 0603: Resistor, Ceramic Chip, 2.2K, 0.1W, 1%, SMD 0603 [LRE027]; FMEDA__OPERATING__VOLTAGE_MIN: 0; FMEDA__OPERATING__TEMP_MIN: -20; FMEDA__OPERATING__TEMP_TYP: 27; FMEDA__OPERATING__TEMP_MAX: 50; FMEDA__CHANNEL: COM; VALUE: 2.2K; FMEDA__OPERATING__VOLTAGE_MAX: 0; FMEDA__OPERATING__POWER_MIN: 0; FMEDA__OPERATING__POWER_MAX: 0; FMEDA__FUNCTION_IN_SYSTEM: *; FMEDA__OPERATING__VOLTAGE_TYP: 0
R44 R56 = 47R / 0.1W / 1% / SMD 0603: as R13 on sheet LPCB235 - RM48 - MAIN; FMEDA__OPERATING__POWER_MIN: 0; FMEDA__OPERATING__VOLTAGE_MAX: 0; FMEDA__OPERATING__VOLTAGE_MIN: 0; FMEDA__OPERATING__VOLTAGE_TYP: 0; FMEDA__FUNCTION_IN_SYSTEM: *
R45 = 49.9R ARRAY / 0.063W / 1% / SMD 0603: Resistor, Array, 49.9R, 0.063W, 1%, SMD 0603 [LRE142]; Value: 49.9; FMEDA__OPERATING__POWER_MAX: 0; FMEDA__OPERATING__TEMP_MAX: 50; FMEDA__OPERATING__TEMP_MIN: -20; FMEDA__OPERATING__TEMP_TYP: 27; FMEDA__CHANNEL: COM; FMEDA__OPERATING__POWER_MIN: 0; FMEDA__OPERATING__VOLTAGE_MAX: 0; FMEDA__OPERATING__VOLTAGE_MIN: 0; FMEDA__OPERATING__VOLTAGE_TYP: 0; FMEDA__FUNCTION_IN_SYSTEM: *
R46 = 2.2K / 0.1W / 1% / SMD 0603: Resistor, Ceramic Chip, 2.2K, 0.1W, 1%, SMD 0603 [LRE027]; FMEDA__OPERATING__POWER_MAX: 0; FMEDA__OPERATING__TEMP_MAX: 50; FMEDA__OPERATING__TEMP_MIN: -20; FMEDA__OPERATING__TEMP_TYP: 27; FMEDA__CHANNEL: COM; VALUE: 2.2K; FMEDA__FUNCTION_IN_SYSTEM: *; FMEDA__OPERATING__POWER_MIN: 0; FMEDA__OPERATING__VOLTAGE_MAX: 0; FMEDA__OPERATING__VOLTAGE_MIN: 0; FMEDA__OPERATING__VOLTAGE_TYP: 0
R47 = 10K / 0.0625W / 1% / SMD 0402: Resistor, Ceramic Chip, 10K, 0.0625W, 1%, SMD 0402 [LRE147]; FMEDA__OPERATING__POWER_MAX: 0; FMEDA__OPERATING__TEMP_MAX: 50; FMEDA__OPERATING__TEMP_MIN: -20; FMEDA__OPERATING__TEMP_TYP: 27; FMEDA__CHANNEL: COM; Value: 10K; FMEDA__OPERATING__POWER_MIN: 0; FMEDA__OPERATING__VOLTAGE_MAX: 0; FMEDA__OPERATING__VOLTAGE_MIN: 0; FMEDA__OPERATING__VOLTAGE_TYP: 0; FMEDA__FUNCTION_IN_SYSTEM: *
R50 = 4.75K / 0.06W / 1% / SMD 0402: as R84 on sheet LPCB235 - RM48 - SERIAL; FMEDA__OPERATING__POWER_MIN: 0; FMEDA__OPERATING__VOLTAGE_MAX: 0; FMEDA__OPERATING__VOLTAGE_MIN: 0; FMEDA__OPERATING__VOLTAGE_TYP: 0; FMEDA__FUNCTION_IN_SYSTEM: *

## Sheet LPCB235 - MAGNETICS.SchDoc
size A3; Address1: Unit 4; DocumentNumber: 23; Revision: 2; SheetNumber: 23; SheetTotal: 37; Lockie__PCB_SUB_ASSEMBLY: Magnetics; Lockie__PCB_ASSEMBLY: FCU PCB; Lockie__LDL: LPCB235; Lockie__PCB_DESCRIPTION: Flight Control Unit
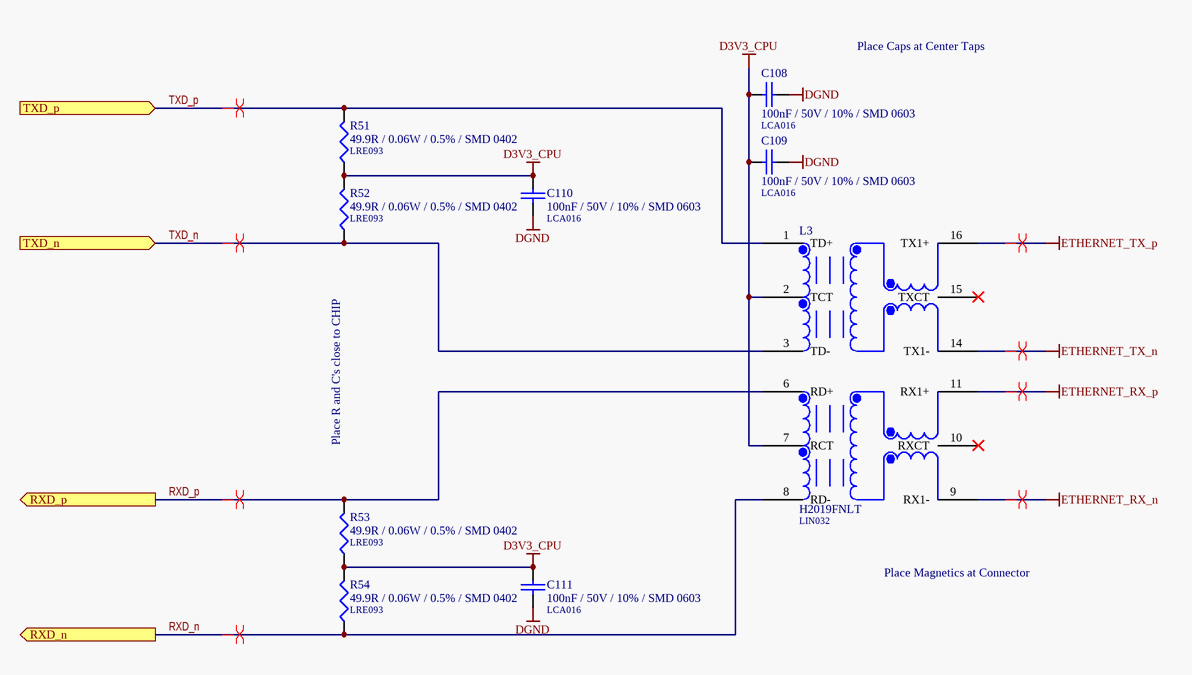
[diagram p11: LPCB235 - MAGNETICS.SchDoc]

### Parts
C108  100nF / 50V / 10% / SMD 0603  LDL_NUMBER: LCA016  [LFP011__CC1608-0603-IPC7351_B]
C109  100nF / 50V / 10% / SMD 0603  LDL_NUMBER: LCA016  [LFP011__CC1608-0603-IPC7351_B]
C110  100nF / 50V / 10% / SMD 0603  LDL_NUMBER: LCA016  [LFP011__CC1608-0603-IPC7351_B]
C111  100nF / 50V / 10% / SMD 0603  LDL_NUMBER: LCA016  [LFP011__CC1608-0603-IPC7351_B]
L3  H2019FNLT  LDL_NUMBER: LIN032  [LFP076__H2019NL]
R51  49.9R / 0.06W / 0.5% / SMD 0402  LDL_NUMBER: LRE093  [LFP030__CR1005-0402-IPC7351]
R52  49.9R / 0.06W / 0.5% / SMD 0402  LDL_NUMBER: LRE093  [LFP030__CR1005-0402-IPC7351]
R53  49.9R / 0.06W / 0.5% / SMD 0402  LDL_NUMBER: LRE093  [LFP030__CR1005-0402-IPC7351]
R54  49.9R / 0.06W / 0.5% / SMD 0402  LDL_NUMBER: LRE093  [LFP030__CR1005-0402-IPC7351]

### Ports
RXD_n (out), RXD_p (out), TXD_n (in), TXD_p (in)

### Nets
D3V3_CPU: C108.1 C109.1 C110.1 C111.1 L3.2(TCT) L3.7(RCT) R51.1 R52.2 R53.1 R54.2
DGND: C108.2 C109.2 C110.2 C111.2
ETHERNET_RX_n: L3.9(RX1-)
ETHERNET_RX_p: L3.11(RX1+)
ETHERNET_TX_n: L3.14(TX1-)
ETHERNET_TX_p: L3.16(TX1+)
RXD_n: L3.8(RD-) R54.1 ; port RXD_n
RXD_p: L3.6(RD+) R53.2 ; port RXD_p
TXD_n: L3.3(TD-) R52.1 ; port TXD_n
TXD_p: L3.1(TD+) R51.2 ; port TXD_p

Not connected (* = marked no-connect by the designer): L3 10(RXCT)* 15(TXCT)*

### Layout directives
differential pair: ETHERNET_RX_n, ETHERNET_RX_p, ETHERNET_TX_n, ETHERNET_TX_p, RXD_n, RXD_p, TXD_n, TXD_p

### Notes on the sheet
- Place Caps at Center Taps
- (near R52) Place R and C's close to CHIP
- Place Magnetics at Connector
- PCB COMPONENT DESCRIPTION
- LDL NUMBER
- Assembly Details
- Size
- Drawing File Name
- Revision
- http://rloop.org
- Scale
- A3
- Sheet Details
- N.T.S
- Sheet:
- Of:

### Library data of the parts
C108-C111 = 100nF / 50V / 10% / SMD 0603: Capacitor, Ceramic Chip, 100nF (0.1uF), 50V, 5%, SMD 0603 [LCA016]; Value: 100n; FMEDA__OPERATING__TEMP_MAX: 50; FMEDA__OPERATING__TEMP_MIN: -20; FMEDA__OPERATING__TEMP_TYP: 27; FMEDA__OPERATING__VOLTAGE_MAX: 3.3; FMEDA__OPERATING__VOLTAGE_MIN: 0; FMEDA__CHANNEL: COM; FMEDA__FUNCTION_IN_SYSTEM: *; FMEDA__OPERATING__VOLTAGE_TYP: 3.3
L3 = H2019FNLT: Transformer, Signal Transformers, SMD [LIN032]; FMEDA__OPERATING__TEMP_MAX: 50; FMEDA__OPERATING__TEMP_MIN: -20; FMEDA__OPERATING__TEMP_TYP: 27; FMEDA__CHANNEL: COM; Revision: July-2002: Re-released for DXP Platform.; FMEDA__FUNCTION_IN_SYSTEM: *
R51-R54 = 49.9R / 0.06W / 0.5% / SMD 0402: Resistor, Ceramic Chip, 49.9R, 0.0625W, 0.5%, SMD 0402 [LRE093]; Value: 49.9; FMEDA__OPERATING__POWER_MAX: 0; FMEDA__OPERATING__TEMP_MAX: 50; FMEDA__OPERATING__TEMP_MIN: -20; FMEDA__OPERATING__TEMP_TYP: 27; FMEDA__CHANNEL: COM; FMEDA__OPERATING__POWER_MIN: 0; FMEDA__OPERATING__VOLTAGE_MAX: 0; FMEDA__OPERATING__VOLTAGE_MIN: 0; FMEDA__OPERATING__VOLTAGE_TYP: 0

## Sheet LPCB235 - RM48 - GIO.SchDoc
size A3; Address1: Unit 4; DocumentNumber: 27; Revision: 2; SheetNumber: 27; SheetTotal: 37; Lockie__PCB_SUB_ASSEMBLY: GPIO; Lockie__PCB_ASSEMBLY: FCU PCB; Lockie__LDL: LPCB235; Lockie__PCB_DESCRIPTION: Flight Control Unit
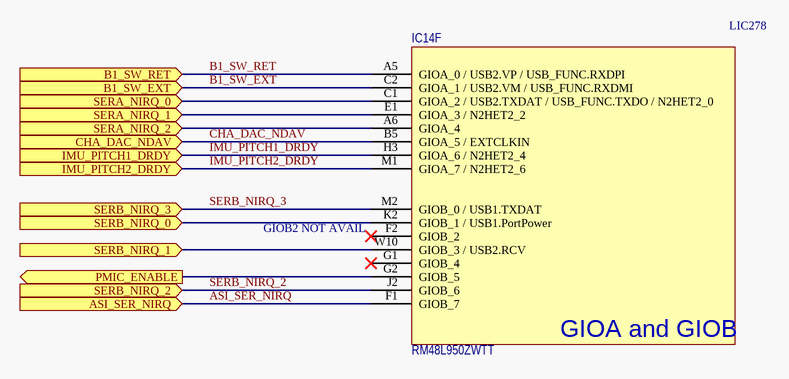
[diagram p12: LPCB235 - RM48 - GIO.SchDoc]

### Parts
IC14  RM48L950ZWTT  LDL_NUMBER: LIC278  [LFP054__ZWT (S-PBGA-N337)]  (part F of 10)

### Ports
ASI_SER_NIRQ (in), B1_SW_EXT (in), B1_SW_RET (in), CHA_DAC_NDAV (in), IMU_PITCH1_DRDY (in), IMU_PITCH2_DRDY (in), PMIC_ENABLE (out), SERA_NIRQ_0 (in), SERA_NIRQ_1 (in), SERA_NIRQ_2 (in), SERB_NIRQ_0 (in), SERB_NIRQ_1 (in), SERB_NIRQ_2 (in), SERB_NIRQ_3 (in)

### Nets
ASI_SER_NIRQ: IC14.F1(GIOB_7) ; port ASI_SER_NIRQ
B1_SW_EXT: IC14.C2(GIOA_1_/_USB2.VM_/_USB_FUNC.RXDMI) ; port B1_SW_EXT
B1_SW_RET: IC14.A5(GIOA_0_/_USB2.VP_/_USB_FUNC.RXDPI) ; port B1_SW_RET
CHA_DAC_NDAV: IC14.B5(GIOA_5_/_EXTCLKIN) ; port CHA_DAC_NDAV
IMU_PITCH1_DRDY: IC14.H3(GIOA_6_/_N2HET2_4) ; port IMU_PITCH1_DRDY
IMU_PITCH2_DRDY: IC14.M1(GIOA_7_/_N2HET2_6) ; port IMU_PITCH2_DRDY
PMIC_ENABLE: IC14.G2(GIOB_5) ; port PMIC_ENABLE
SERA_NIRQ_0: IC14.C1(GIOA_2_/_USB2.TXDAT_/_USB_FUNC.TXDO_/_N2HET2_0) ; port SERA_NIRQ_0
SERA_NIRQ_1: IC14.E1(GIOA_3_/_N2HET2_2) ; port SERA_NIRQ_1
SERA_NIRQ_2: IC14.A6(GIOA_4) ; port SERA_NIRQ_2
SERB_NIRQ_0: IC14.K2(GIOB_1_/_USB1.PortPower) ; port SERB_NIRQ_0
SERB_NIRQ_1: IC14.W10(GIOB_3_/_USB2.RCV) ; port SERB_NIRQ_1
SERB_NIRQ_2: IC14.J2(GIOB_6) ; port SERB_NIRQ_2
SERB_NIRQ_3: IC14.M2(GIOB_0_/_USB1.TXDAT) ; port SERB_NIRQ_3

Not connected (* = marked no-connect by the designer): IC14 F2(GIOB_2)* G1(GIOB_4)*

### Notes on the sheet
- GIOB2 NOT AVAIL
- PCB COMPONENT DESCRIPTION
- LDL NUMBER
- Assembly Details
- Size
- Drawing File Name
- Revision
- http://rloop.org
- Scale
- A3
- Sheet Details
- N.T.S
- Sheet:
- Of:
- (in symbol RM48L950ZWTT, part F) GIOA and GIOB

### Library data of the parts
IC14 = RM48L950ZWTT: as IC14 on sheet LPCB235 - RM48 - ANALOG

## Sheet LPCB235 - RM48 - N2HET.SchDoc
size A3; Address1: Unit 4; DocumentNumber: 29; Revision: 2; SheetNumber: 29; SheetTotal: 37; Lockie__PCB_SUB_ASSEMBLY: N2HET; Lockie__PCB_ASSEMBLY: FCU PCB; Lockie__LDL: LPCB235; Lockie__PCB_DESCRIPTION: Flight Control Unit
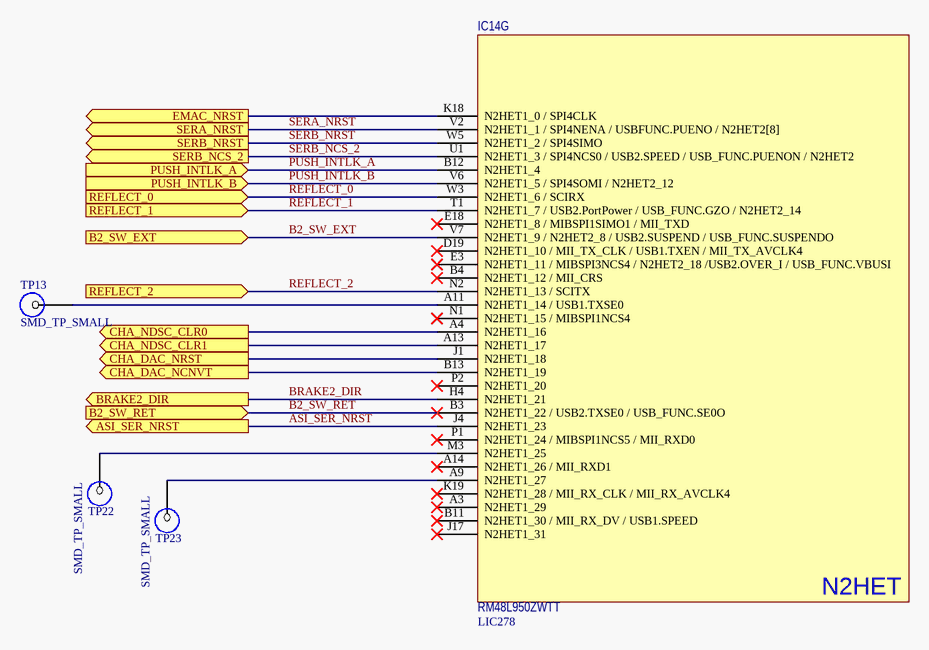
[diagram p13: LPCB235 - RM48 - N2HET.SchDoc]

### Parts
IC14  RM48L950ZWTT  LDL_NUMBER: LIC278  [LFP054__ZWT (S-PBGA-N337)]  (part G of 10)
TP13  SMD_TP_SMALL  [SMD-TP-SMALL]  (no BOM)
TP22  SMD_TP_SMALL  [SMD-TP-SMALL]  (no BOM)
TP23  SMD_TP_SMALL  [SMD-TP-SMALL]  (no BOM)

### Ports
ASI_SER_NRST (out), B2_SW_EXT (in), B2_SW_RET (in), BRAKE2_DIR (out), CHA_DAC_NCNVT (out), CHA_DAC_NRST (out), CHA_NDSC_CLR0 (out), CHA_NDSC_CLR1 (out), EMAC_NRST (out), PUSH_INTLK_A (in), PUSH_INTLK_B (in), REFLECT_0 (in), REFLECT_1 (in), REFLECT_2 (in), SERA_NRST (out), SERB_NCS_2 (out), SERB_NRST (out)

### Nets
ASI_SER_NRST: IC14.J4(N2HET1_23) ; port ASI_SER_NRST
B2_SW_EXT: IC14.V7(N2HET1_9_/_N2HET2_8_/_USB2.SUSPEND_/_USB_FUNC.SUSPENDO) ; port B2_SW_EXT
B2_SW_RET: IC14.B3(N2HET1_22_/_USB2.TXSE0_/_USB_FUNC.SE0O) ; port B2_SW_RET
BRAKE2_DIR: IC14.H4(N2HET1_21) ; port BRAKE2_DIR
CHA_DAC_NCNVT: IC14.B13(N2HET1_19) ; port CHA_DAC_NCNVT
CHA_DAC_NRST: IC14.J1(N2HET1_18) ; port CHA_DAC_NRST
CHA_NDSC_CLR0: IC14.A4(N2HET1_16) ; port CHA_NDSC_CLR0
CHA_NDSC_CLR1: IC14.A13(N2HET1_17) ; port CHA_NDSC_CLR1
MII_RXD0: IC14.P1(N2HET1_24_/_MIBSPI1NCS5_/_MII_RXD0)
MII_RXD1: IC14.A14(N2HET1_26_/_MII_RXD1)
PUSH_INTLK_A: IC14.B12(N2HET1_4) ; port PUSH_INTLK_A
PUSH_INTLK_B: IC14.V6(N2HET1_5_/_SPI4SOMI_/_N2HET2_12) ; port PUSH_INTLK_B
REFLECT_0: IC14.W3(N2HET1_6_/_SCIRX) ; port REFLECT_0
REFLECT_1: IC14.T1(N2HET1_7_/_USB2.PortPower_/_USB_FUNC.GZO_/_N2HET2_14) ; port REFLECT_1
REFLECT_2: IC14.N2(N2HET1_13_/_SCITX) ; port REFLECT_2
SERA_NRST: IC14.V2(N2HET1_1_/_SPI4NENA_/_USBFUNC.PUENO_/_N2HET2[8]) ; port SERA_NRST
SERB_NCS_2: IC14.U1(N2HET1_3_/_SPI4NCS0_/_USB2.SPEED_/_USB_FUNC.PUENON_/_N2HET2) ; port SERB_NCS_2
SERB_NRST: IC14.W5(N2HET1_2_/_SPI4SIMO) ; port SERB_NRST
NetIC14_A9: IC14.A9(N2HET1_27) TP23.1
NetIC14_A11: IC14.A11(N2HET1_14_/_USB1.TXSE0) TP13.1
NetIC14_B4: IC14.B4(N2HET1_12_/_MII_CRS)
NetIC14_B11: IC14.B11(N2HET1_30_/_MII_RX_DV_/_USB1.SPEED)
NetIC14_D19: IC14.D19(N2HET1_10_/_MII_TX_CLK_/_USB1.TXEN_/_MII_TX_AVCLK4)
NetIC14_E18: IC14.E18(N2HET1_8_/_MIBSPI1SIMO1_/_MII_TXD)
NetIC14_K18: IC14.K18(N2HET1_0_/_SPI4CLK) ; port EMAC_NRST
NetIC14_K19: IC14.K19(N2HET1_28_/_MII_RX_CLK_/_MII_RX_AVCLK4)
NetIC14_M3: IC14.M3(N2HET1_25) TP22.1

Not connected (* = marked no-connect by the designer): IC14 A3(N2HET1_29)* E3(N2HET1_11_/_MIBSPI3NCS4_/_N2HET2_18_/USB2.OVER_I_/_USB_FUNC.VBUSI)* J17(N2HET1_31)* N1(N2HET1_15_/_MIBSPI1NCS4)* P2(N2HET1_20)*

### Notes on the sheet
- PCB COMPONENT DESCRIPTION
- LDL NUMBER
- Assembly Details
- Size
- Drawing File Name
- Revision
- http://rloop.org
- Scale
- A3
- Sheet Details
- N.T.S
- Sheet:
- Of:
- (in symbol RM48L950ZWTT, part G) N2HET

### Library data of the parts
IC14 = RM48L950ZWTT: as IC14 on sheet LPCB235 - RM48 - ANALOG
TP13 TP22 TP23 = SMD_TP_SMALL: as TP12 on sheet LPCB235 - RM48 - ANALOG; FMEDA__OPERATING__CURRENT_MIN: 0; FMEDA__OPERATING__CURRENT_TYP: 0; FMEDA__OPERATING__VOLTAGE_MIN: 0

## Sheet LPCB235 - IMU.SchDoc
size A3; Address1: Unit 4; DocumentNumber: 14; Revision: 2; SheetNumber: 14; SheetTotal: 37; Lockie__PCB_SUB_ASSEMBLY: Inertial Measurement Unit; Lockie__PCB_ASSEMBLY: FCU PCB; Lockie__LDL: LPCB235; Lockie__PCB_DESCRIPTION: Flight Control Unit
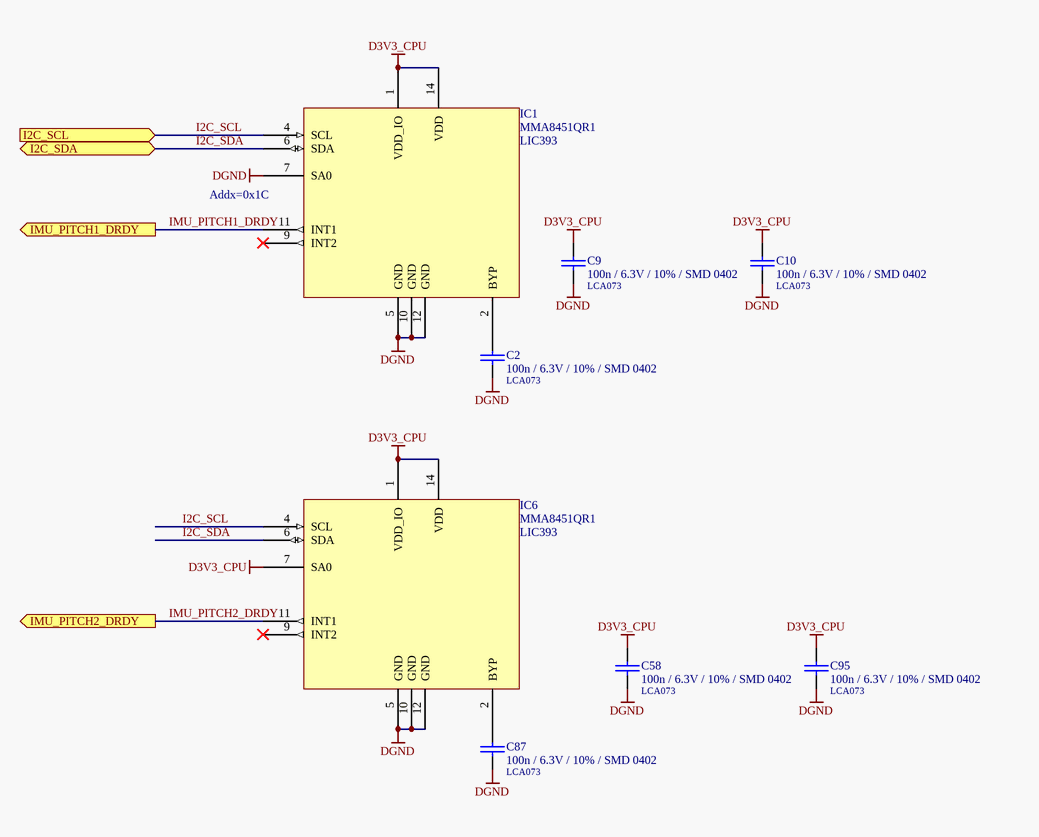
[diagram p14: LPCB235 - IMU.SchDoc]

### Parts
C2  100n / 6.3V / 10% / SMD 0402  LDL_NUMBER: LCA073  [LFP012__CC1005-0402-IPC7351_B]
C9  100n / 6.3V / 10% / SMD 0402  LDL_NUMBER: LCA073  [LFP012__CC1005-0402-IPC7351_B]
C10  100n / 6.3V / 10% / SMD 0402  LDL_NUMBER: LCA073  [LFP012__CC1005-0402-IPC7351_B]
C58  100n / 6.3V / 10% / SMD 0402  LDL_NUMBER: LCA073  [LFP012__CC1005-0402-IPC7351_B]
C87  100n / 6.3V / 10% / SMD 0402  LDL_NUMBER: LCA073  [LFP012__CC1005-0402-IPC7351_B]
C95  100n / 6.3V / 10% / SMD 0402  LDL_NUMBER: LCA073  [LFP012__CC1005-0402-IPC7351_B]
IC1  MMA8451QR1  LDL_NUMBER: LIC393  [LFP051__QFN16]
IC6  MMA8451QR1  LDL_NUMBER: LIC393  [LFP051__QFN16]

### Ports
I2C_SCL (in), I2C_SDA (bidir), IMU_PITCH1_DRDY (out), IMU_PITCH2_DRDY (out)

### Nets
D3V3_CPU: C9.1 C10.1 C58.1 C95.1 IC1.1(VDD_IO) IC1.14(VDD) IC6.1(VDD_IO) IC6.7(SA0) IC6.14(VDD)
DGND: C2.2 C9.2 C10.2 C58.2 C87.2 C95.2 IC1.5(GND) IC1.7(SA0) IC1.10(GND) IC1.12(GND) IC6.5(GND) IC6.10(GND) IC6.12(GND)
I2C_SCL: IC1.4(SCL) IC6.4(SCL) ; port I2C_SCL
I2C_SDA: IC1.6(SDA) IC6.6(SDA) ; port I2C_SDA
IMU_PITCH1_DRDY: IC1.11(INT1) ; port IMU_PITCH1_DRDY
IMU_PITCH2_DRDY: IC6.11(INT1) ; port IMU_PITCH2_DRDY
NetC2_1: C2.1 IC1.2(BYP)
NetC87_1: C87.1 IC6.2(BYP)

Not connected (* = marked no-connect by the designer): IC1 9(INT2)*; IC6 9(INT2)*

### Notes on the sheet
- (near IC1) Addx=0x1C
- PCB COMPONENT DESCRIPTION
- LDL NUMBER
- Assembly Details
- Size
- Drawing File Name
- Revision
- http://rloop.org
- Scale
- A3
- Sheet Details
- N.T.S
- Sheet:
- Of:

### Library data of the parts
C2 = 100n / 6.3V / 10% / SMD 0402: Capacitor, Ceramic Chip, 100nF (0.1uF), 6.3V, 10%, SMD 0402 [LCA073]; FMEDA__FUNCTION_IN_SYSTEM: PITCH ACCEL 1 FILTER; FMEDA__OPERATING__TEMP_MAX: 50; FMEDA__OPERATING__TEMP_TYP: 27; FMEDA__OPERATING__TEMP_MIN: -20; FMEDA__OPERATING__VOLTAGE_MAX: 3.3; FMEDA__OPERATING__VOLTAGE_MIN: 0; FMEDA__CHANNEL: COM; Value: 100n; FMEDA__OPERATING__VOLTAGE_TYP: 3.3
C9 C10 C58 C95 = 100n / 6.3V / 10% / SMD 0402: Capacitor, Ceramic Chip, 100nF (0.1uF), 6.3V, 10%, SMD 0402 [LCA073]; FMEDA__FUNCTION_IN_SYSTEM: ACCEL BYPASS; FMEDA__OPERATING__TEMP_MAX: 50; FMEDA__OPERATING__TEMP_TYP: 27; FMEDA__OPERATING__TEMP_MIN: -20; FMEDA__OPERATING__VOLTAGE_MAX: 3.3; FMEDA__OPERATING__VOLTAGE_MIN: 0; FMEDA__CHANNEL: COM; Value: 100n; FMEDA__OPERATING__VOLTAGE_TYP: 3.3
C87 = 100n / 6.3V / 10% / SMD 0402: Capacitor, Ceramic Chip, 100nF (0.1uF), 6.3V, 10%, SMD 0402 [LCA073]; FMEDA__FUNCTION_IN_SYSTEM: PITCH ACCEL 2 FILTER; FMEDA__OPERATING__TEMP_MAX: 50; FMEDA__OPERATING__TEMP_TYP: 27; FMEDA__OPERATING__TEMP_MIN: -20; FMEDA__OPERATING__VOLTAGE_MAX: 3.3; FMEDA__OPERATING__VOLTAGE_MIN: 0; FMEDA__CHANNEL: COM; Value: 100n; FMEDA__OPERATING__VOLTAGE_TYP: 3.3
IC1 IC6 = MMA8451QR1: IC, Accelerometer, 3-Axis, 3.3V, I2C, SMD QFN16 [LIC393]; FMEDA__OPERATING__TEMP_MAX: 50; FMEDA__OPERATING__TEMP_MIN: -20; FMEDA__OPERATING__TEMP_TYP: 27; FMEDA__OPERATING__VOLTAGE_MAX: 3.3; FMEDA__OPERATING__VOLTAGE_MIN: 0; FMEDA__CHANNEL: COM; FMEDA__OPERATING__VOLTAGE_TYP: 3.3; FMEDA__FUNCTION_IN_SYSTEM: *

## Sheet LPCB235 - MECHANICAL.SchDoc
size A3; Address1: Factory 10; Address2: 9-13 Dingley Avenue, Dandeong, VICTORIA 3175, AUSTRALIA; DocumentNumber: 16; Revision: 1; SheetNumber: 16; SheetTotal: 37; Lockie__PCB_SUB_ASSEMBLY: Mechanical Parts; Lockie__PCB_ASSEMBLY: FCU PCB; Lockie__LDL: LPCB235; Lockie__PCB_DESCRIPTION: Flight Control Unit
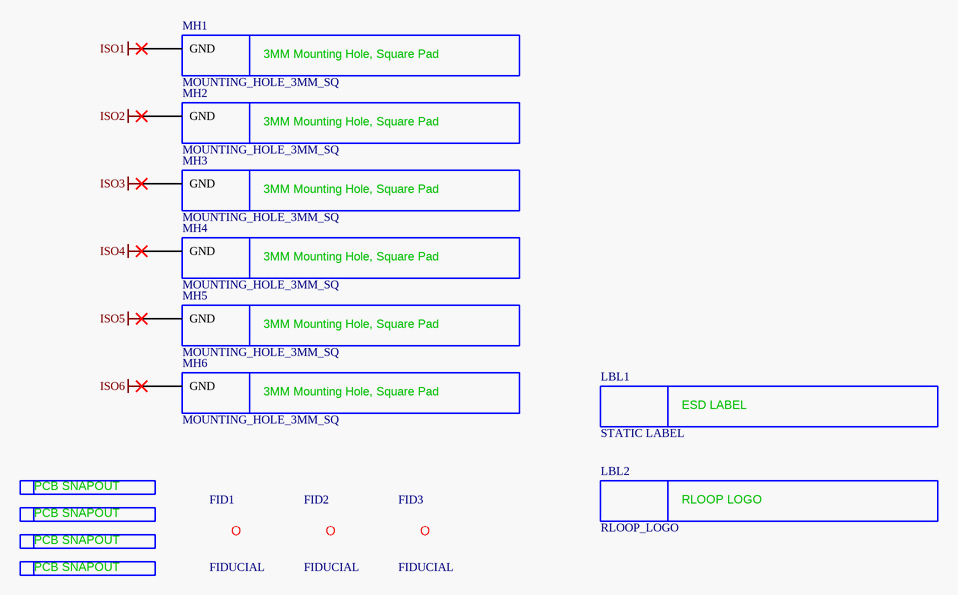
[diagram p15: LPCB235 - MECHANICAL.SchDoc]

### Parts
FID1  FIDUCIAL  [LFP113__FIDUCIAL]  (no BOM)
FID2  FIDUCIAL  [LFP113__FIDUCIAL]  (no BOM)
FID3  FIDUCIAL  [LFP113__FIDUCIAL]  (no BOM)
LBL1  STATIC LABEL  [STATIC_LABEL]  (no BOM)
LBL2  RLOOP_LOGO  [RLOOP_LOGO]  (no BOM)
MH1  MOUNTING_HOLE_3MM_SQ  [MOUNTING_HOLE_3MM_SQ]  (no BOM)
MH2  MOUNTING_HOLE_3MM_SQ  [MOUNTING_HOLE_3MM_SQ]  (no BOM)
MH3  MOUNTING_HOLE_3MM_SQ  [MOUNTING_HOLE_3MM_SQ]  (no BOM)
MH4  MOUNTING_HOLE_3MM_SQ  [MOUNTING_HOLE_3MM_SQ]  (no BOM)
MH5  MOUNTING_HOLE_3MM_SQ  [MOUNTING_HOLE_3MM_SQ]  (no BOM)
MH6  MOUNTING_HOLE_3MM_SQ  [MOUNTING_HOLE_3MM_SQ]  (no BOM)
SN1  PCB_SNAPOUT  [SNAPOUT_NEW]  (value not drawn)  (no BOM)
SN2  PCB_SNAPOUT  [SNAPOUT_NEW]  (value not drawn)  (no BOM)
SN3  PCB_SNAPOUT  [SNAPOUT_NEW]  (value not drawn)  (no BOM)
SN4  PCB_SNAPOUT  [SNAPOUT_NEW]  (value not drawn)  (no BOM)

### Nets
ISO1: MH1.MOUNT(GND)
ISO2: MH2.MOUNT(GND)
ISO3: MH3.MOUNT(GND)
ISO4: MH4.MOUNT(GND)
ISO5: MH5.MOUNT(GND)
ISO6: MH6.MOUNT(GND)

### Notes on the sheet
- PCB COMPONENT DESCRIPTION
- LDL NUMBER
- Assembly Details
- Size
- Drawing File Name
- Revision
- http://rloop.org
- Scale
- A3
- Sheet Details
- N.T.S
- Sheet:
- Of:
- (in symbol MOUNTING_HOLE_3MM_SQ) 3MM Mounting Hole, Square Pad
- (in symbol PCB_SNAPOUT) PCB SNAPOUT
- (in symbol RLOOP_LOGO) RLOOP LOGO
- (in symbol STATIC LABEL) ESD LABEL

### Library data of the parts
FID1-FID3 = FIDUCIAL: SMD Device Fiducial; FMEDA__CHANNEL: COM
LBL1 = STATIC LABEL: FMEDA__CHANNEL: DIAG; FMEDA__FUNCTION_IN_SYSTEM: *
LBL2 = RLOOP_LOGO: FMEDA__CHANNEL: DIAG; FMEDA__FUNCTION_IN_SYSTEM: *
MH1-MH6 = MOUNTING_HOLE_3MM_SQ: 3MM Mouting Hole, Square; FMEDA__CHANNEL: DIAG; FMEDA__FUNCTION_IN_SYSTEM: *

## Sheet LPCB235 - SPI UART - GROUP B.SchDoc
size A3; Address1: Factory 10; Address2: 9-13 Dingley Avenue, Dandeong, VICTORIA 3175, AUSTRALIA; DocumentNumber: 34; Revision: 1; SheetNumber: 34; SheetTotal: 37; Lockie__PCB_SUB_ASSEMBLY: SPI UARTS B; Lockie__PCB_ASSEMBLY: FCU PCB; Lockie__LDL: LPCB235; Lockie__PCB_DESCRIPTION: Flight Control Unit
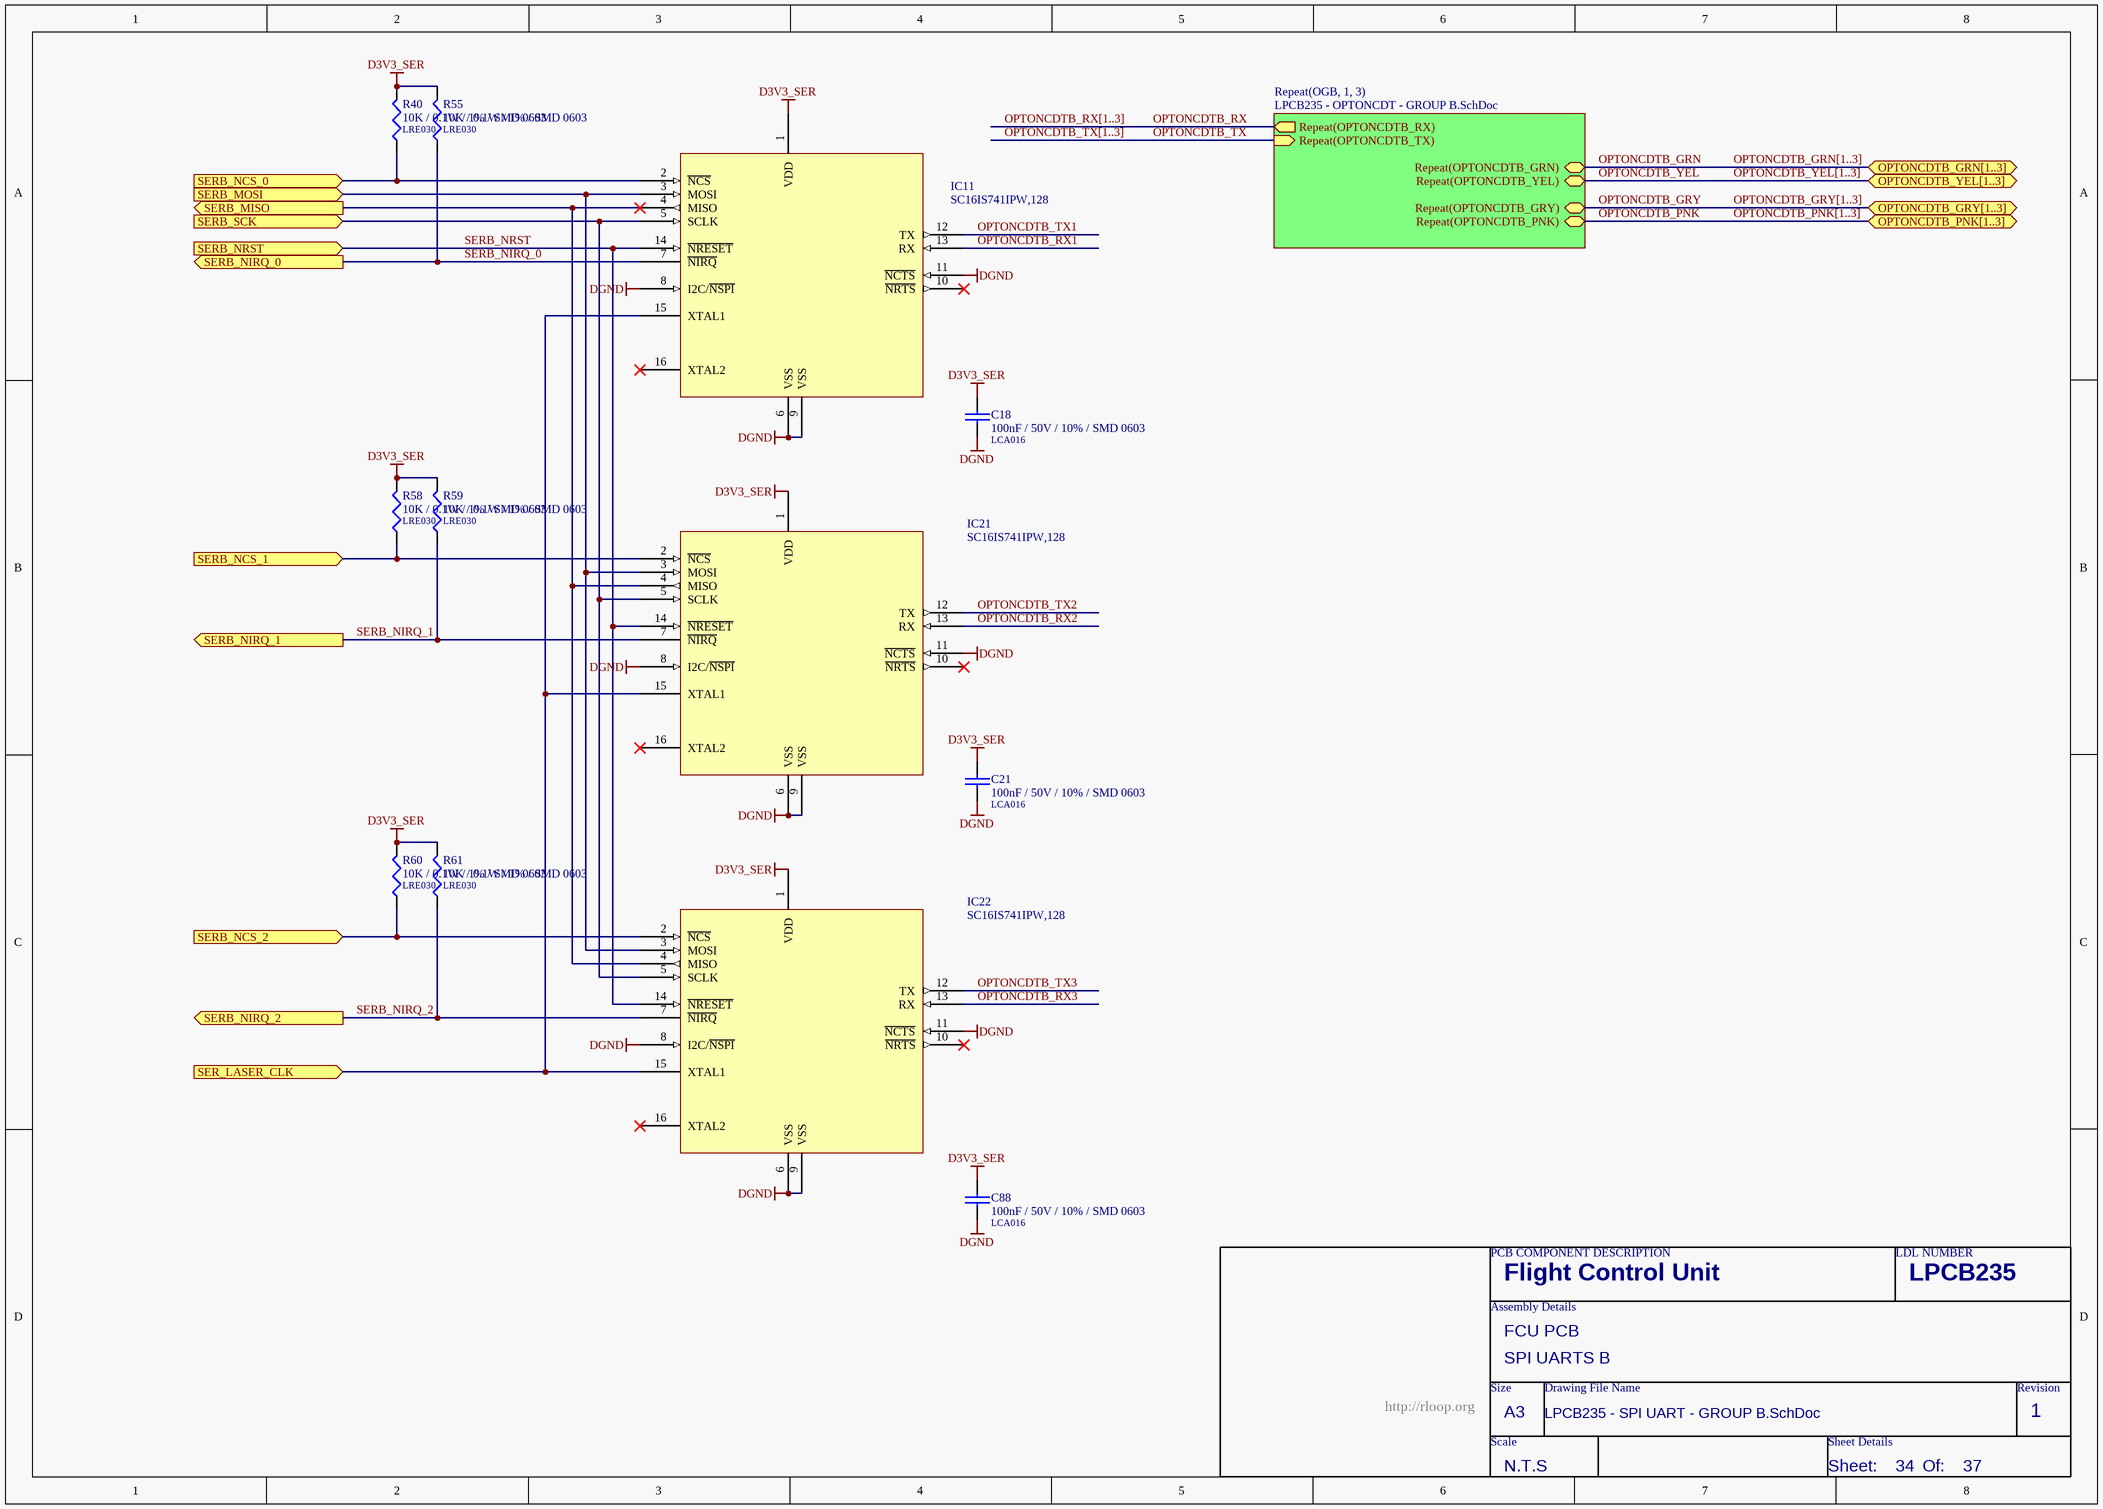
[diagram p16: LPCB235 - SPI UART - GROUP B.SchDoc]

### Parts
C18  100nF / 50V / 10% / SMD 0603  LDL_NUMBER: LCA016  [LFP011__CC1608-0603-IPC7351_B]
C21  100nF / 50V / 10% / SMD 0603  LDL_NUMBER: LCA016  [LFP011__CC1608-0603-IPC7351_B]
C88  100nF / 50V / 10% / SMD 0603  LDL_NUMBER: LCA016  [LFP011__CC1608-0603-IPC7351_B]
IC11  SC16IS741IPW,128  [LFP049__TSSOP-16]
IC21  SC16IS741IPW,128  [LFP049__TSSOP-16]
IC22  SC16IS741IPW,128  [LFP049__TSSOP-16]
R40  10K / 0.1W / 1% / SMD 0603  LDL_NUMBER: LRE030  [LFP020__CR1608-0603-IPC7351_B]
R55  10K / 0.1W / 1% / SMD 0603  LDL_NUMBER: LRE030  [LFP020__CR1608-0603-IPC7351_B]
R58  10K / 0.1W / 1% / SMD 0603  LDL_NUMBER: LRE030  [LFP020__CR1608-0603-IPC7351_B]
R59  10K / 0.1W / 1% / SMD 0603  LDL_NUMBER: LRE030  [LFP020__CR1608-0603-IPC7351_B]
R60  10K / 0.1W / 1% / SMD 0603  LDL_NUMBER: LRE030  [LFP020__CR1608-0603-IPC7351_B]
R61  10K / 0.1W / 1% / SMD 0603  LDL_NUMBER: LRE030  [LFP020__CR1608-0603-IPC7351_B]

### Sub-sheets
Repeat(OGB, 1, 3) = LPCB235 - OPTONCDT - GROUP B.SchDoc: Repeat(OPTONCDTB_GRN) (bidir), Repeat(OPTONCDTB_YEL) (bidir), Repeat(OPTONCDTB_GRY) (bidir), Repeat(OPTONCDTB_PNK) (bidir), Repeat(OPTONCDTB_RX) (out), Repeat(OPTONCDTB_TX) (in)

### Ports
OPTONCDTB_GRN[1..3] (bidir), OPTONCDTB_GRY[1..3] (bidir), OPTONCDTB_PNK[1..3] (bidir), OPTONCDTB_YEL[1..3] (bidir), SER_LASER_CLK (in), SERB_MISO (out), SERB_MOSI (in), SERB_NCS_0 (in), SERB_NCS_1 (in), SERB_NCS_2 (in), SERB_NIRQ_0 (out), SERB_NIRQ_1 (out), SERB_NIRQ_2 (out), SERB_NRST (in), SERB_SCK (in)

### Nets
D3V3_SER: C18.1 C21.1 C88.1 IC11.1(VDD) IC21.1(VDD) IC22.1(VDD) R40.2 R55.2 R58.2 R59.2 R60.2 R61.2
DGND: C18.2 C21.2 C88.2 IC11.6(VSS) IC11.8(I2C/~{NSPI}) IC11.9(VSS) IC11.11(~{NCTS}) IC21.6(VSS) IC21.8(I2C/~{NSPI}) IC21.9(VSS) IC21.11(~{NCTS}) IC22.6(VSS) IC22.8(I2C/~{NSPI}) IC22.9(VSS) IC22.11(~{NCTS})
OPTONCDTB_GRN: sheet Repeat(OGB, 1, 3)/Repeat(OPTONCDTB_GRN)
OPTONCDTB_GRY: sheet Repeat(OGB, 1, 3)/Repeat(OPTONCDTB_GRY)
OPTONCDTB_PNK: sheet Repeat(OGB, 1, 3)/Repeat(OPTONCDTB_PNK)
OPTONCDTB_RX: sheet Repeat(OGB, 1, 3)/Repeat(OPTONCDTB_RX)
OPTONCDTB_RX1: IC11.13(RX)
OPTONCDTB_RX2: IC21.13(RX)
OPTONCDTB_RX3: IC22.13(RX)
OPTONCDTB_TX: sheet Repeat(OGB, 1, 3)/Repeat(OPTONCDTB_TX)
OPTONCDTB_TX1: IC11.12(TX)
OPTONCDTB_TX2: IC21.12(TX)
OPTONCDTB_TX3: IC22.12(TX)
OPTONCDTB_YEL: sheet Repeat(OGB, 1, 3)/Repeat(OPTONCDTB_YEL)
SER_LASER_CLK: IC11.15(XTAL1) IC21.15(XTAL1) IC22.15(XTAL1) ; port SER_LASER_CLK
SERB_MISO: IC11.4(MISO) IC21.4(MISO) IC22.4(MISO) ; port SERB_MISO
SERB_MOSI: IC11.3(MOSI) IC21.3(MOSI) IC22.3(MOSI) ; port SERB_MOSI
SERB_NCS_0: IC11.2(~{NCS}) R40.1 ; port SERB_NCS_0
SERB_NCS_1: IC21.2(~{NCS}) R58.1 ; port SERB_NCS_1
SERB_NCS_2: IC22.2(~{NCS}) R60.1 ; port SERB_NCS_2
SERB_NIRQ_0: IC11.7(~{NIRQ}) R55.1 ; port SERB_NIRQ_0
SERB_NIRQ_1: IC21.7(~{NIRQ}) R59.1 ; port SERB_NIRQ_1
SERB_NIRQ_2: IC22.7(~{NIRQ}) R61.1 ; port SERB_NIRQ_2
SERB_NRST: IC11.14(~{NRESET}) IC21.14(~{NRESET}) IC22.14(~{NRESET}) ; port SERB_NRST
SERB_SCK: IC11.5(SCLK) IC21.5(SCLK) IC22.5(SCLK) ; port SERB_SCK

Not connected (* = marked no-connect by the designer): IC11 10(~{NRTS})* 16(XTAL2)*; IC21 10(~{NRTS})* 16(XTAL2)*; IC22 10(~{NRTS})* 16(XTAL2)*

### Buses and harness runs
bus OPTONCDTB_GRN[1..3] = port OPTONCDTB_GRN[1..3]
bus OPTONCDTB_GRY[1..3] = port OPTONCDTB_GRY[1..3]
bus OPTONCDTB_PNK[1..3] = port OPTONCDTB_PNK[1..3]
bus OPTONCDTB_RX[1..3]
bus OPTONCDTB_TX[1..3]
bus OPTONCDTB_YEL[1..3] = port OPTONCDTB_YEL[1..3]

### Notes on the sheet
- PCB COMPONENT DESCRIPTION
- LDL NUMBER
- Assembly Details
- Size
- Drawing File Name
- Revision
- http://rloop.org
- Scale
- A3
- Sheet Details
- N.T.S
- Sheet:
- Of:

### Library data of the parts
C18 C21 C88 = 100nF / 50V / 10% / SMD 0603: as C5 on sheet LPCB235 - CAN Interface; FMEDA__FUNCTION_IN_SYSTEM: *; FMEDA__OPERATING__VOLTAGE_TYP: 3.3
IC11 IC21 IC22 = SC16IS741IPW,128: IC, SPI to UART bridge [LIC472]; FMEDA__CHANNEL: COM; LDL_NUMBER: LIC472; FMEDA__FUNCTION_IN_SYSTEM: *
R40 R55 R58-R61 = 10K / 0.1W / 1% / SMD 0603: as R12 on sheet LPCB235 - RM48 - MAIN; Value: 10K; FMEDA__OPERATING__POWER_MIN: 0; FMEDA__OPERATING__VOLTAGE_MAX: 0; FMEDA__OPERATING__VOLTAGE_MIN: 0; FMEDA__OPERATING__VOLTAGE_TYP: 0; FMEDA__FUNCTION_IN_SYSTEM: *

## Sheet LPCB235 - OPTONCDT - GROUP B.SchDoc
size A3; Address1: Factory 10; Address2: 9-13 Dingley Avenue, Dandeong, VICTORIA 3175, AUSTRALIA; DocumentNumber: 35; Revision: 1; SheetNumber: 35; SheetTotal: 37; Lockie__PCB_SUB_ASSEMBLY: OptoNCDT Group B; Lockie__PCB_ASSEMBLY: FCU PCB; Lockie__LDL: LPCB235; Lockie__PCB_DESCRIPTION: Flight Control Unit
Used 3 times, as channels U_LPCB235 - SPI UART - GROUP B/OGB1, U_LPCB235 - SPI UART - GROUP B/OGB2, U_LPCB235 - SPI UART - GROUP B/OGB3. Parts and nets are listed once, with the designators drawn on the sheet.
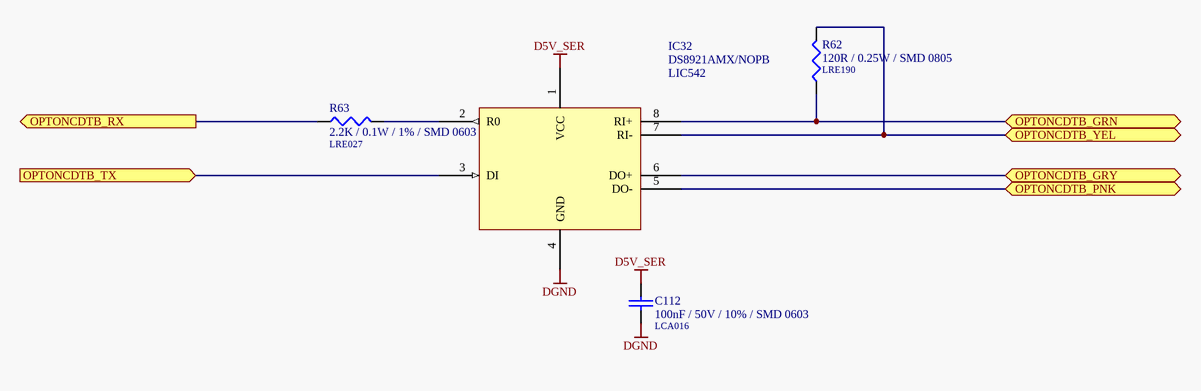
[diagram p17: LPCB235 - OPTONCDT - GROUP B.SchDoc]

### Parts
C112  100nF / 50V / 10% / SMD 0603  LDL_NUMBER: LCA016  [LFP011__CC1608-0603-IPC7351_B]
IC32  DS8921AMX/NOPB  LDL_NUMBER: LIC542  [LFP069__R-8G]
R62  120R / 0.25W / SMD 0805  LDL_NUMBER: LRE190  [LFP029__CR2012-0805]
R63  2.2K / 0.1W / 1% / SMD 0603  LDL_NUMBER: LRE027  [LFP020__CR1608-0603-IPC7351_B]

### Ports
OPTONCDTB_GRN (bidir), OPTONCDTB_GRY (bidir), OPTONCDTB_PNK (bidir), OPTONCDTB_RX (out), OPTONCDTB_TX (in), OPTONCDTB_YEL (bidir)

### Nets
D5V_SER: C112.1 IC32.1(VCC)
DGND: C112.2 IC32.4(GND)
OPTONCDTB_GRN: IC32.8(RI+) R62.1 ; port OPTONCDTB_GRN
OPTONCDTB_GRY: IC32.6(DO+) ; port OPTONCDTB_GRY
OPTONCDTB_PNK: IC32.5(DO-) ; port OPTONCDTB_PNK
OPTONCDTB_RX: R63.1 ; port OPTONCDTB_RX
OPTONCDTB_TX: IC32.3(DI) ; port OPTONCDTB_TX
OPTONCDTB_YEL: IC32.7(RI-) R62.2 ; port OPTONCDTB_YEL
NetIC32_2: IC32.2(R0) R63.2

### Channels
U_LPCB235 - SPI UART - GROUP B/OGB1: designators end in _OGB1; ports OPTONCDTB_GRN=OPTONCDTB_GRN1 OPTONCDTB_GRY=OPTONCDTB_GRY1 OPTONCDTB_PNK=OPTONCDTB_PNK1 OPTONCDTB_RX=OPTONCDTB_RX1 OPTONCDTB_TX=OPTONCDTB_TX1 OPTONCDTB_YEL=OPTONCDTB_YEL1
U_LPCB235 - SPI UART - GROUP B/OGB2: designators end in _OGB2; ports OPTONCDTB_GRN=OPTONCDTB_GRN2 OPTONCDTB_GRY=OPTONCDTB_GRY2 OPTONCDTB_PNK=OPTONCDTB_PNK2 OPTONCDTB_RX=OPTONCDTB_RX2 OPTONCDTB_TX=OPTONCDTB_TX2 OPTONCDTB_YEL=OPTONCDTB_YEL2
U_LPCB235 - SPI UART - GROUP B/OGB3: designators end in _OGB3; ports OPTONCDTB_GRN=OPTONCDTB_GRN3 OPTONCDTB_GRY=OPTONCDTB_GRY3 OPTONCDTB_PNK=OPTONCDTB_PNK3 OPTONCDTB_RX=OPTONCDTB_RX3 OPTONCDTB_TX=OPTONCDTB_TX3 OPTONCDTB_YEL=OPTONCDTB_YEL3

### Notes on the sheet
- PCB COMPONENT DESCRIPTION
- LDL NUMBER
- Assembly Details
- Size
- Drawing File Name
- Revision
- http://rloop.org
- Scale
- A3
- Sheet Details
- N.T.S
- Sheet:
- Of:

### Library data of the parts
C112 = 100nF / 50V / 10% / SMD 0603: as C5 on sheet LPCB235 - CAN Interface; FMEDA__FUNCTION_IN_SYSTEM: *; FMEDA__OPERATING__VOLTAGE_TYP: 3.3
IC32 = DS8921AMX/NOPB: IC, RS422 Tx Rx, SMD SOIC 8
R62 = 120R / 0.25W / SMD 0805: Resistor, Thick Film, 120R, 0.25W, 5%, SMD 0805 [LRE190]; Value: 120; FMEDA__OPERATING__POWER_MAX: 0; FMEDA__OPERATING__TEMP_MAX: 155; FMEDA__OPERATING__TEMP_MIN: -55; FMEDA__OPERATING__TEMP_TYP: 27; FMEDA__OPERATING__VOLTAGE_TYP: 150; FMEDA__CHANNEL: COM; FMEDA__OPERATING__POWER_MIN: 0; FMEDA__OPERATING__VOLTAGE_MAX: 0; FMEDA__OPERATING__VOLTAGE_MIN: 0; FMEDA__FUNCTION_IN_SYSTEM: *
R63 = 2.2K / 0.1W / 1% / SMD 0603: as R41 on sheet LPCB235 - RM48 - 100BASET; VALUE: 2.2K; FMEDA__OPERATING__VOLTAGE_MAX: 0; FMEDA__OPERATING__POWER_MIN: 0; FMEDA__OPERATING__POWER_MAX: 0; FMEDA__FUNCTION_IN_SYSTEM: *; FMEDA__OPERATING__VOLTAGE_TYP: 0